# EasyEDA schematic LcsNodes-Block-Quad-Controller-B.00.05.json

## Sheets
1 High Level Schematic: TITLE: LcsNodes-Block-Quad-Controller\nHigh Level Schematic; REV: B.01.00; Date: 2023-02-08; Sheet: 1/7; Drawn By: helmut-f; Company: Your Company
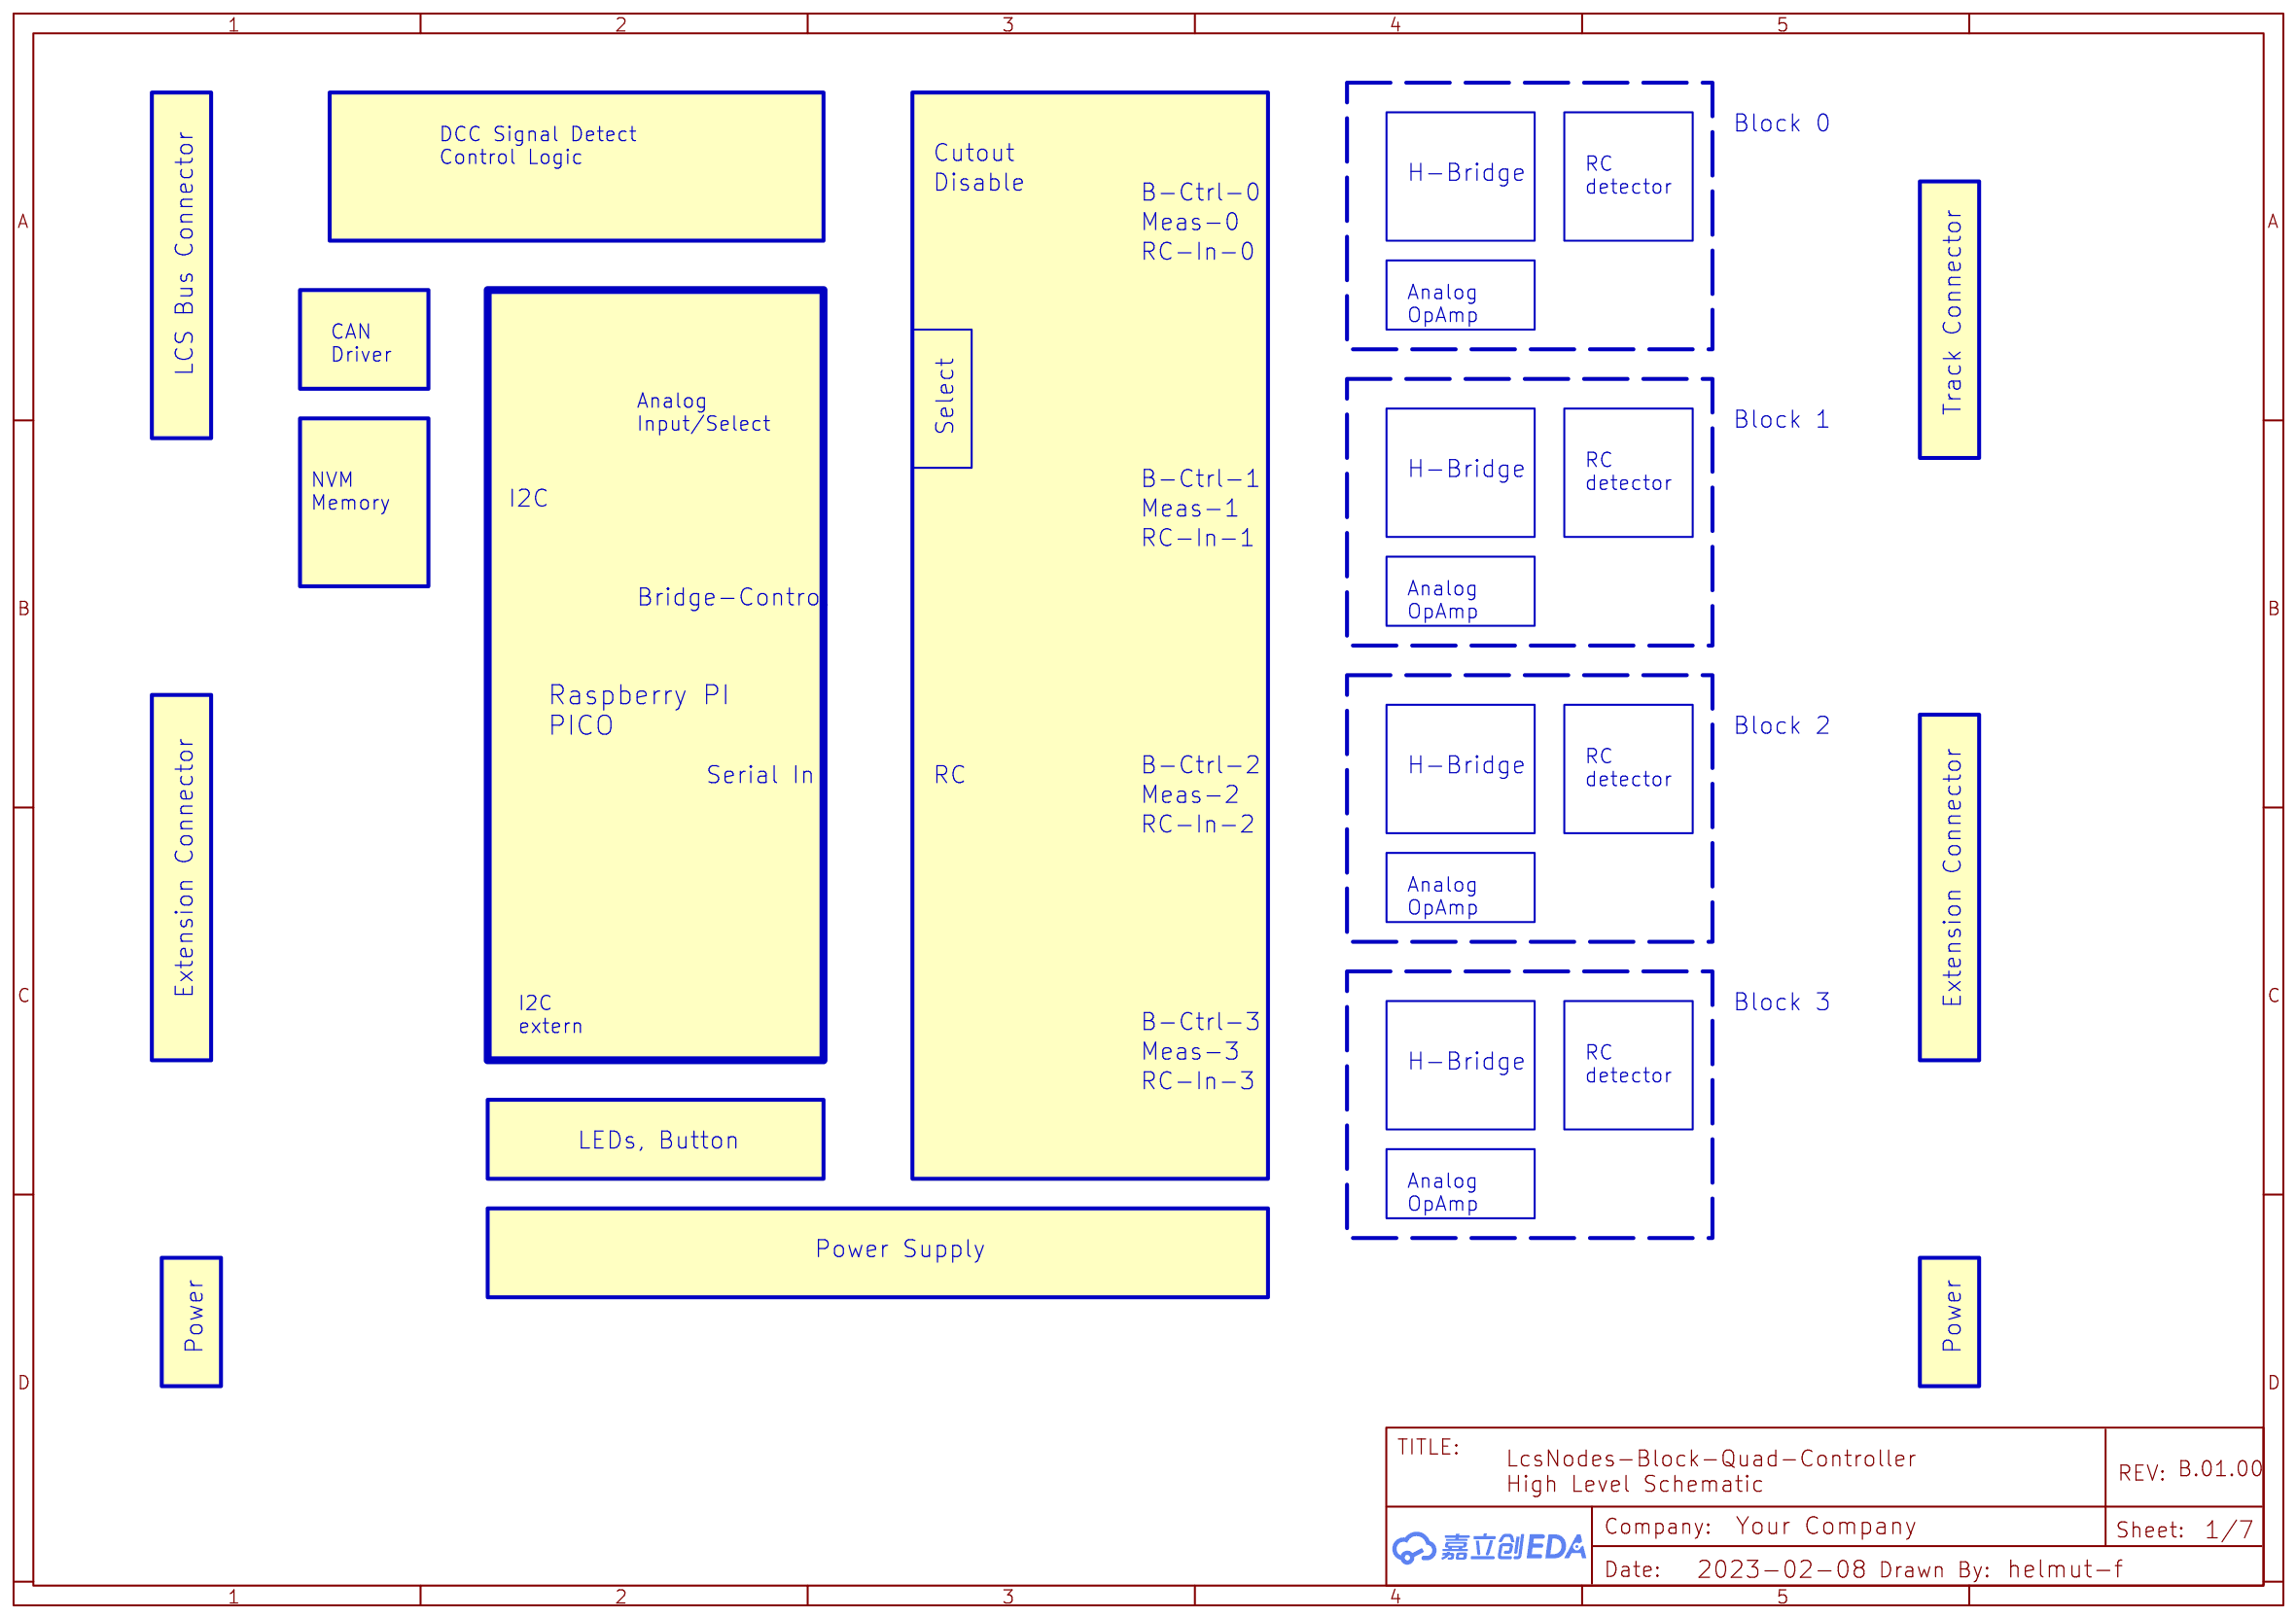
[diagram p0: High Level Schematic]
2 Control Logic: TITLE: LcsNodes-Block-Quad-Controller\nControl Logic; REV: B.00.04; Date: 2023-02-18; Sheet: 3/7
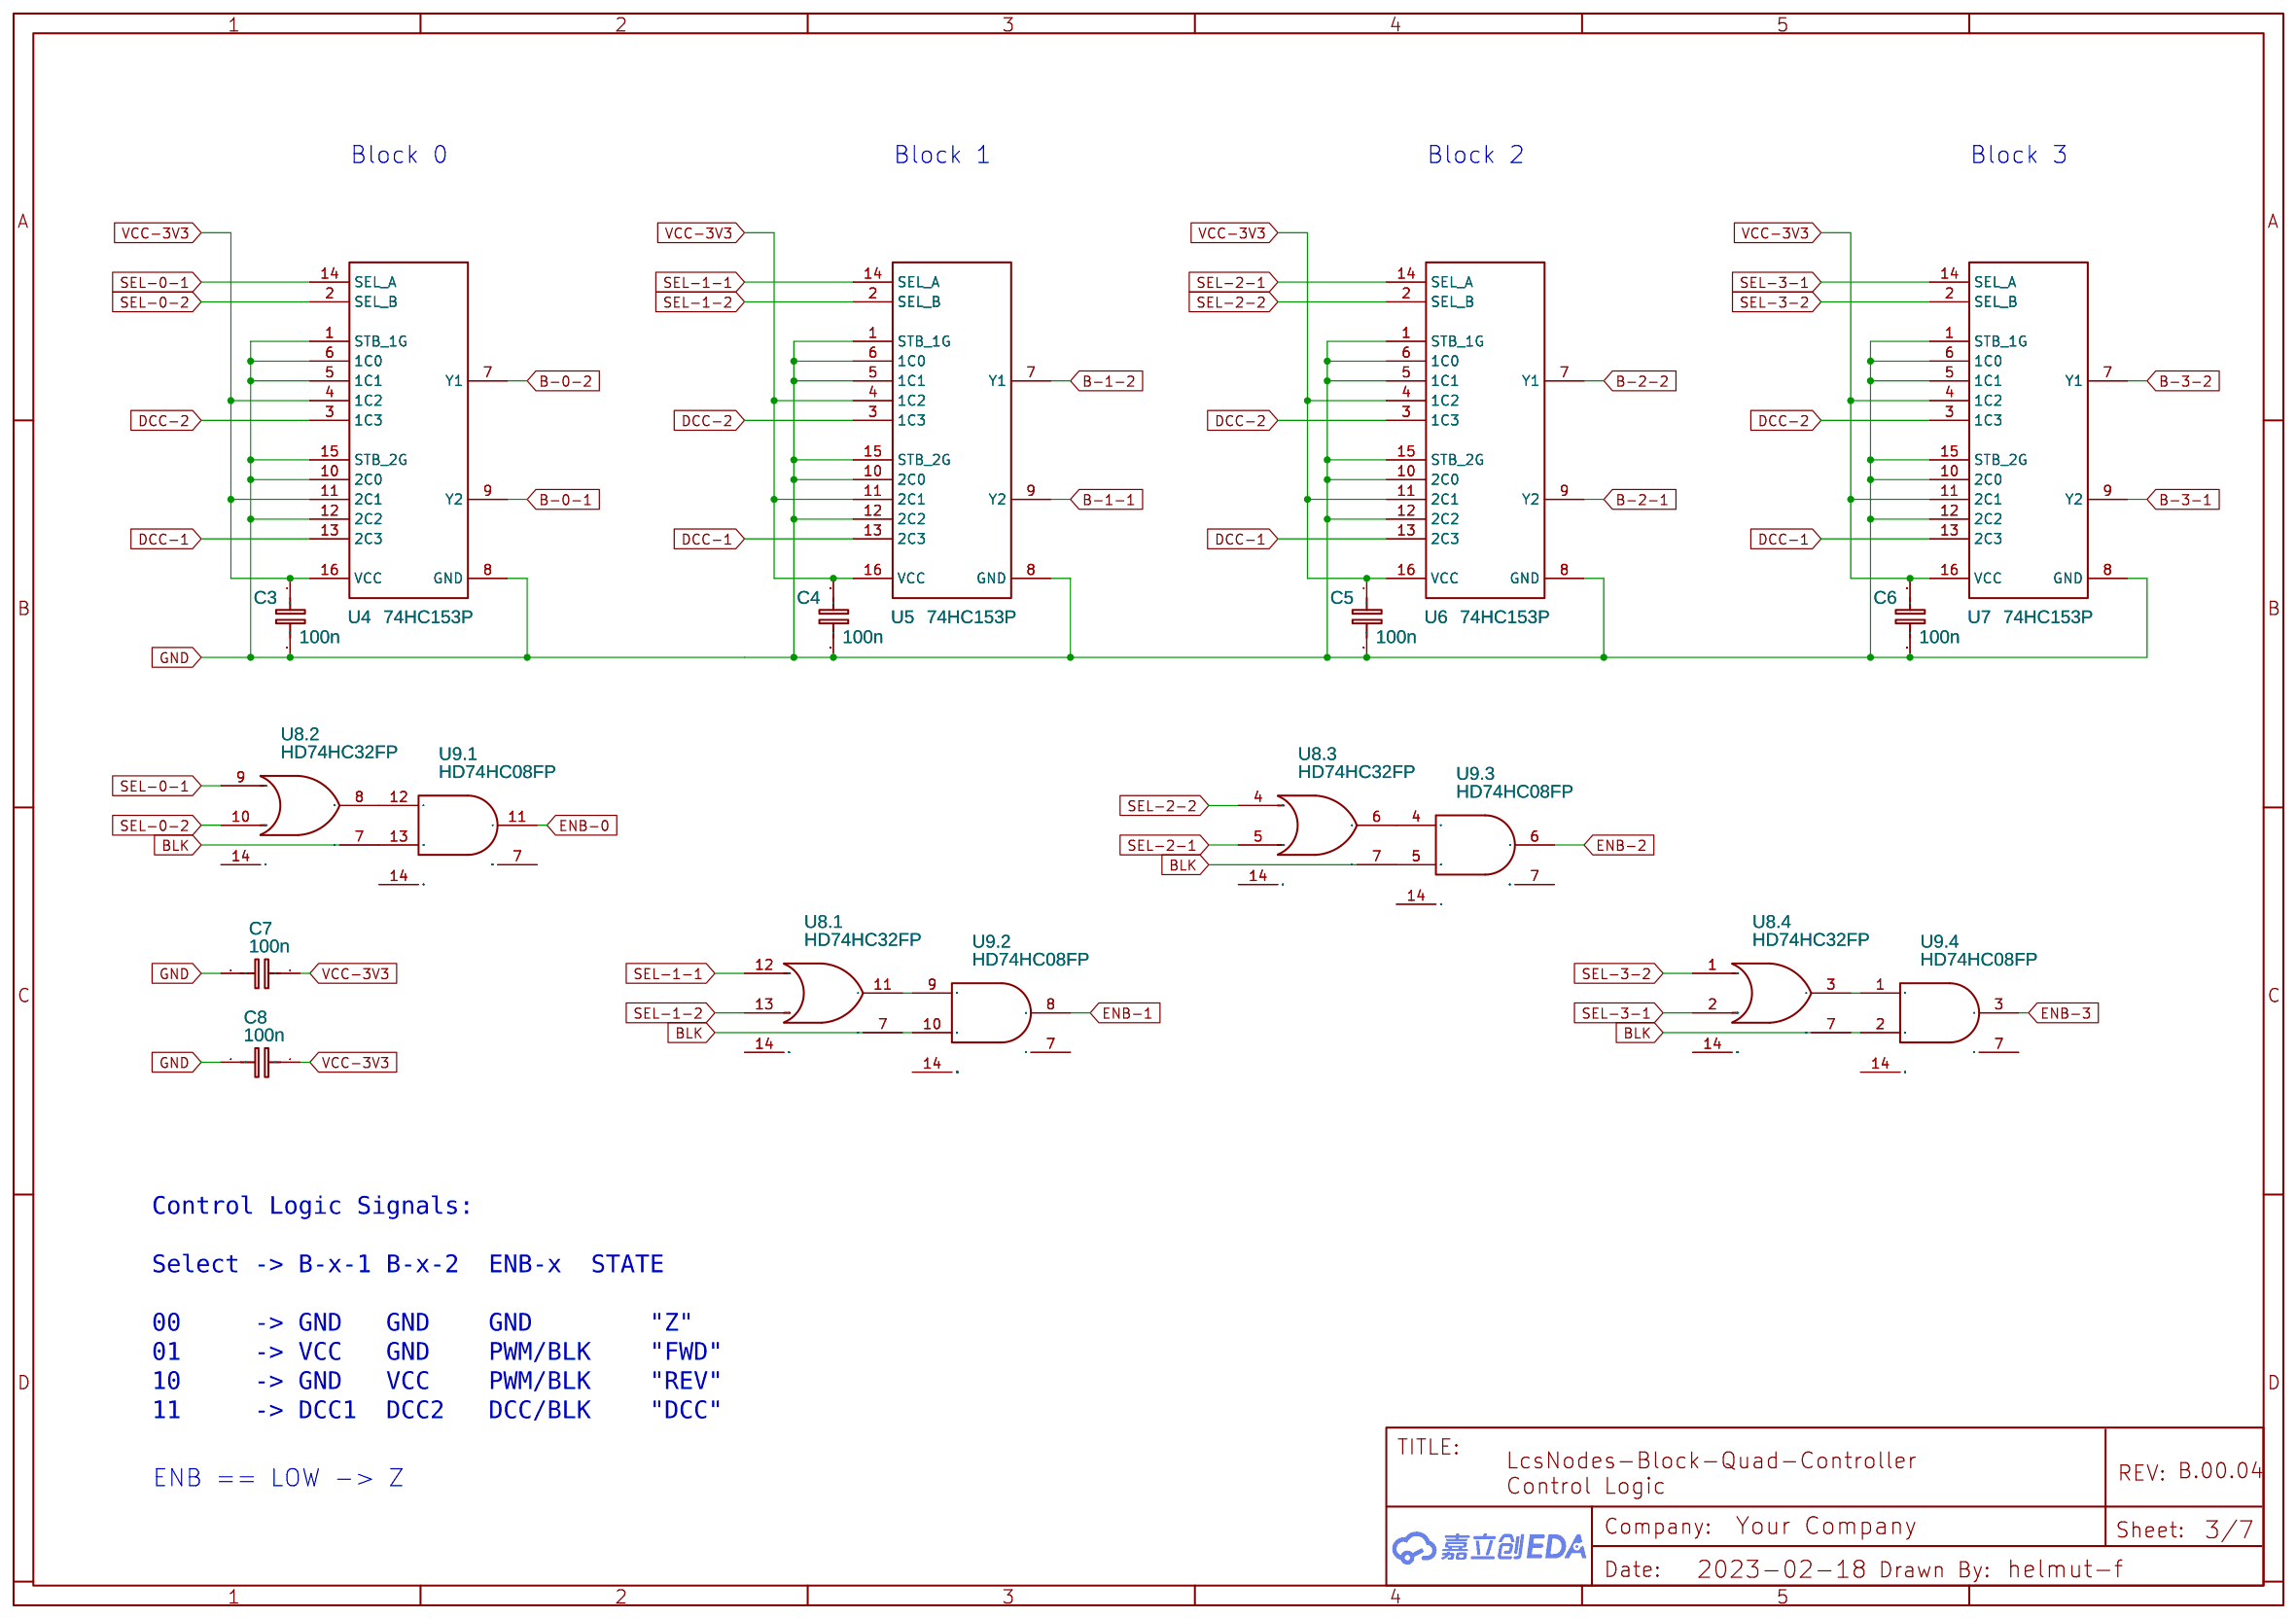
[diagram p1: Control Logic]
3 Main Controller: TITLE: LcsNodes-Block-Quad-Controller\nMain Controller; REV: B.00.04; Date: 2023-02-18; Sheet: 2/7
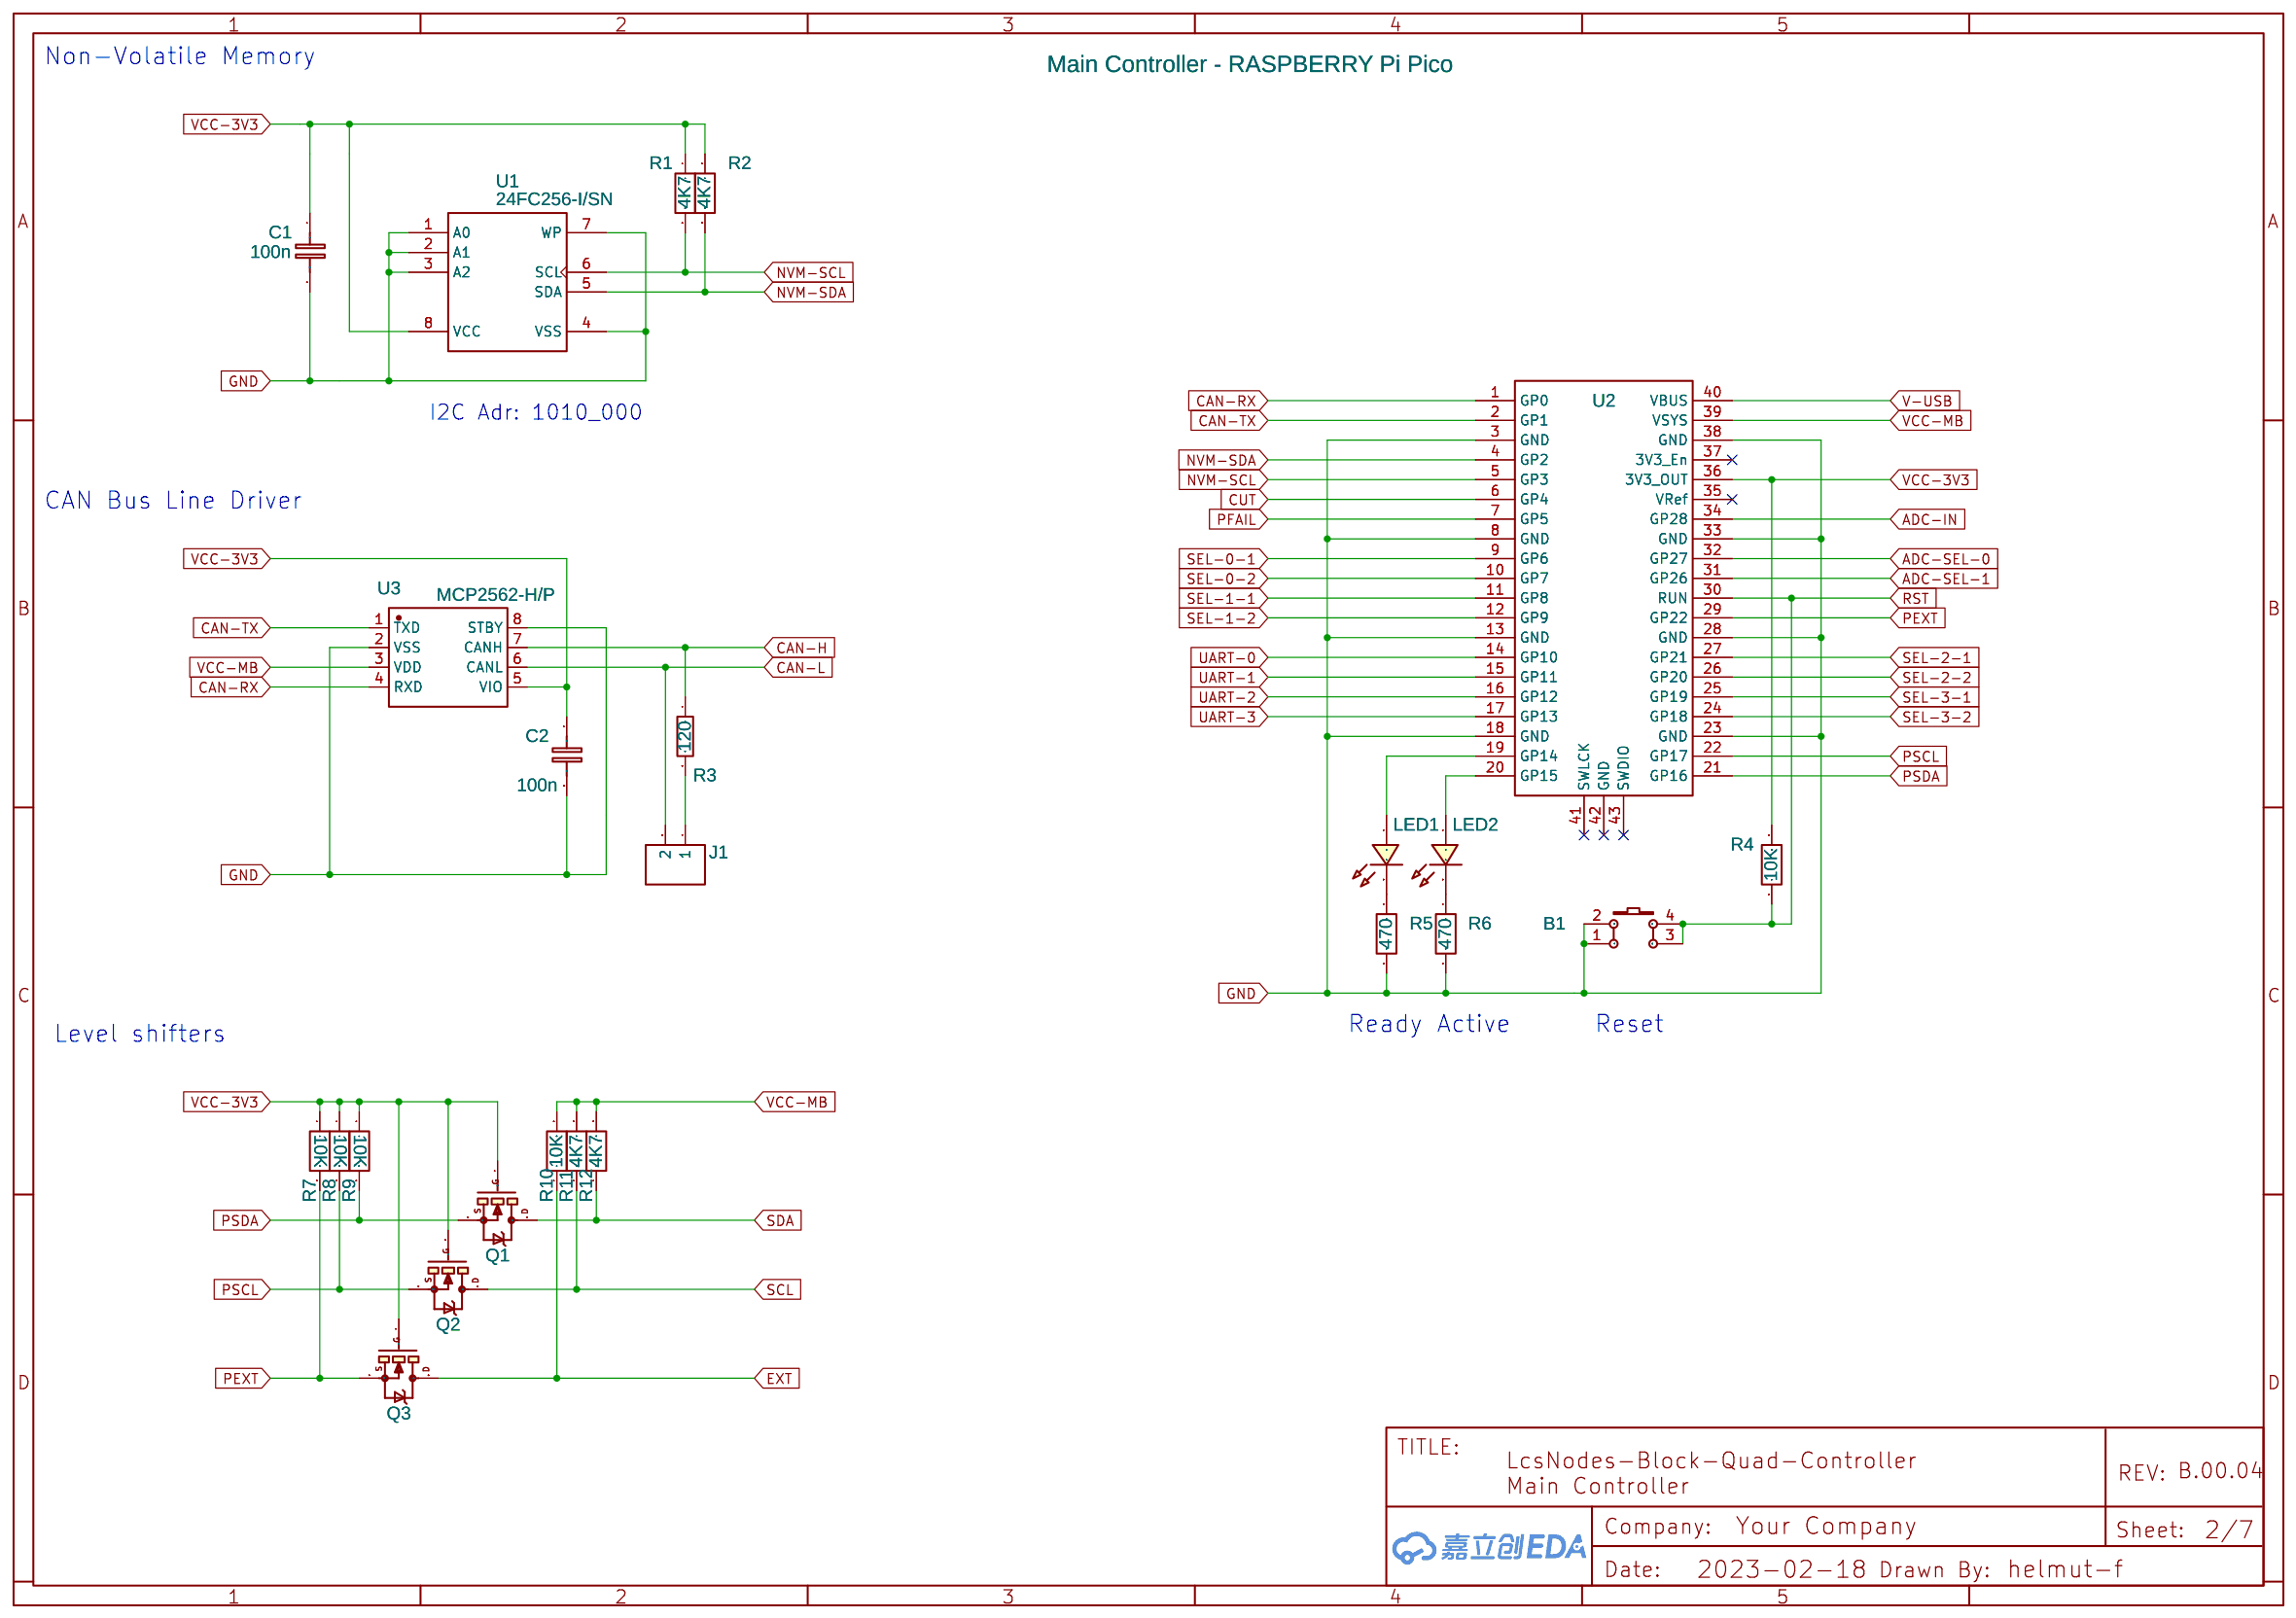
[diagram p2: Main Controller]
4 Quad Power Unit: TITLE: LcsNodes-Block-Quad-Controller\nQuad Power Unit; REV: B.00.04; Date: 2023-02-18; Sheet: 4/7
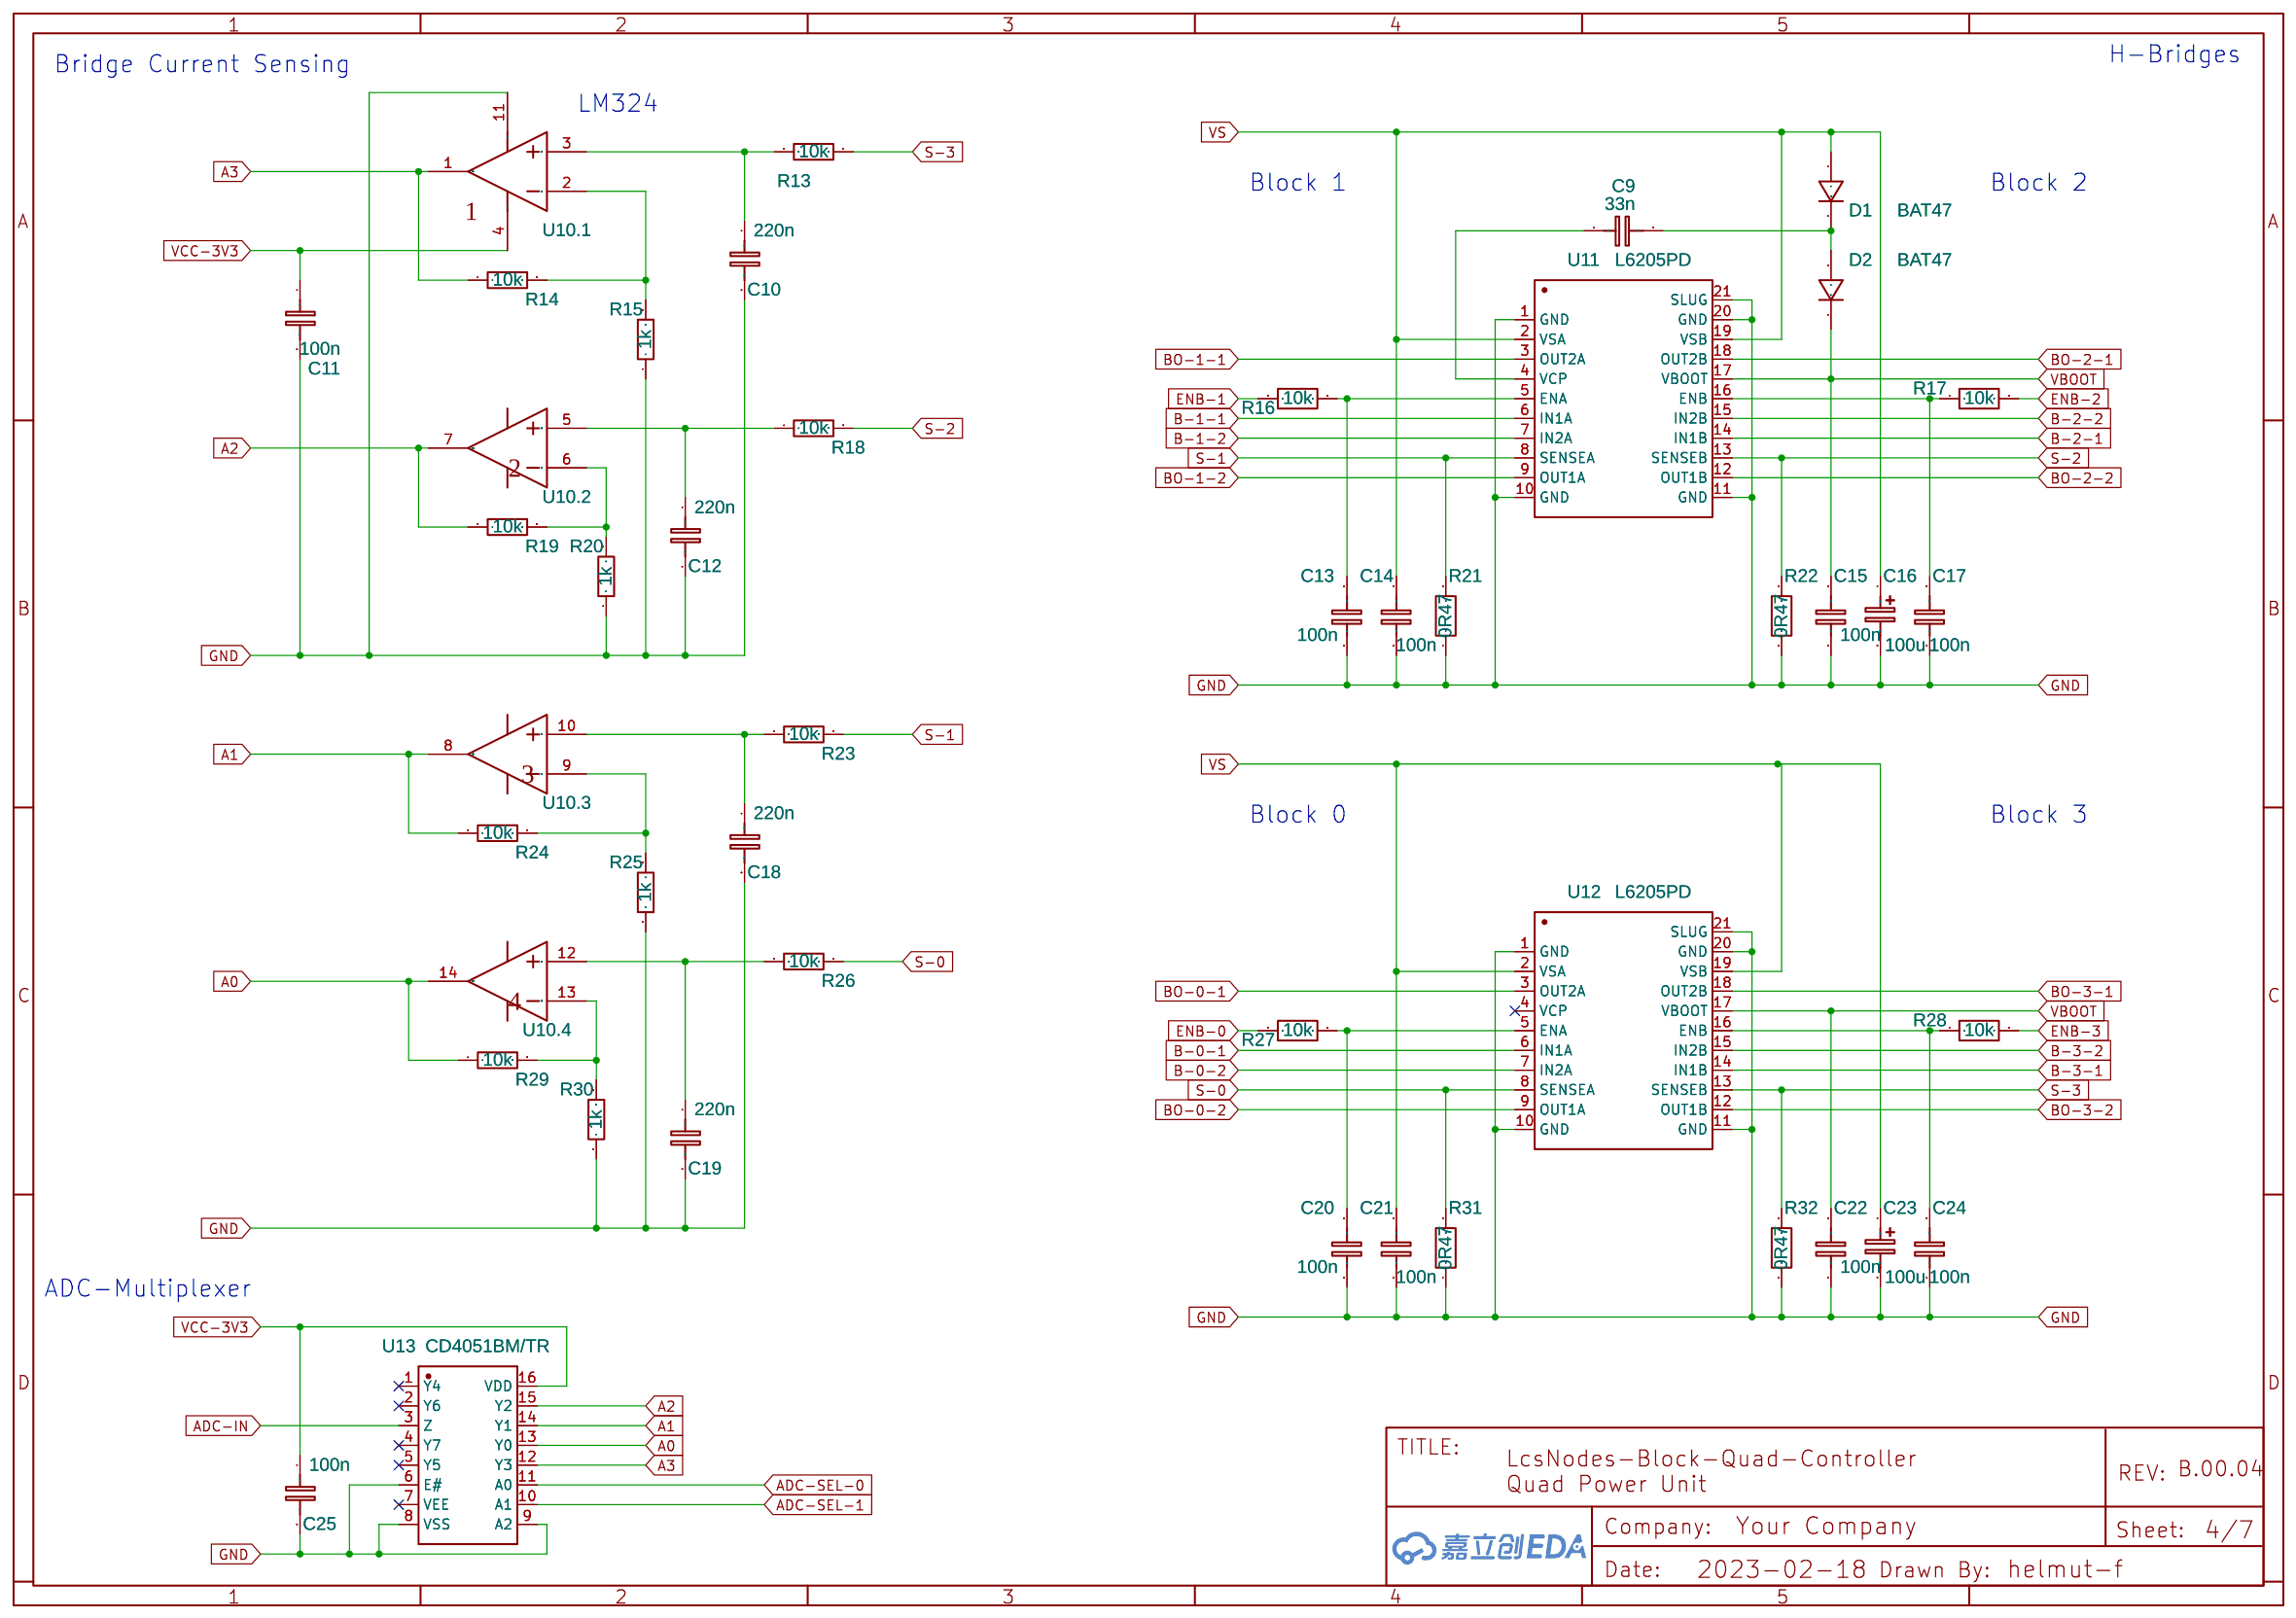
[diagram p3: Quad Power Unit]
5 Quad RailCom Detector: TITLE: LcsNodes-Block-Quad-Controllern\nQuad RailCom Detector; REV: B.00.04; Date: 2023-02-18; Sheet: 5/7
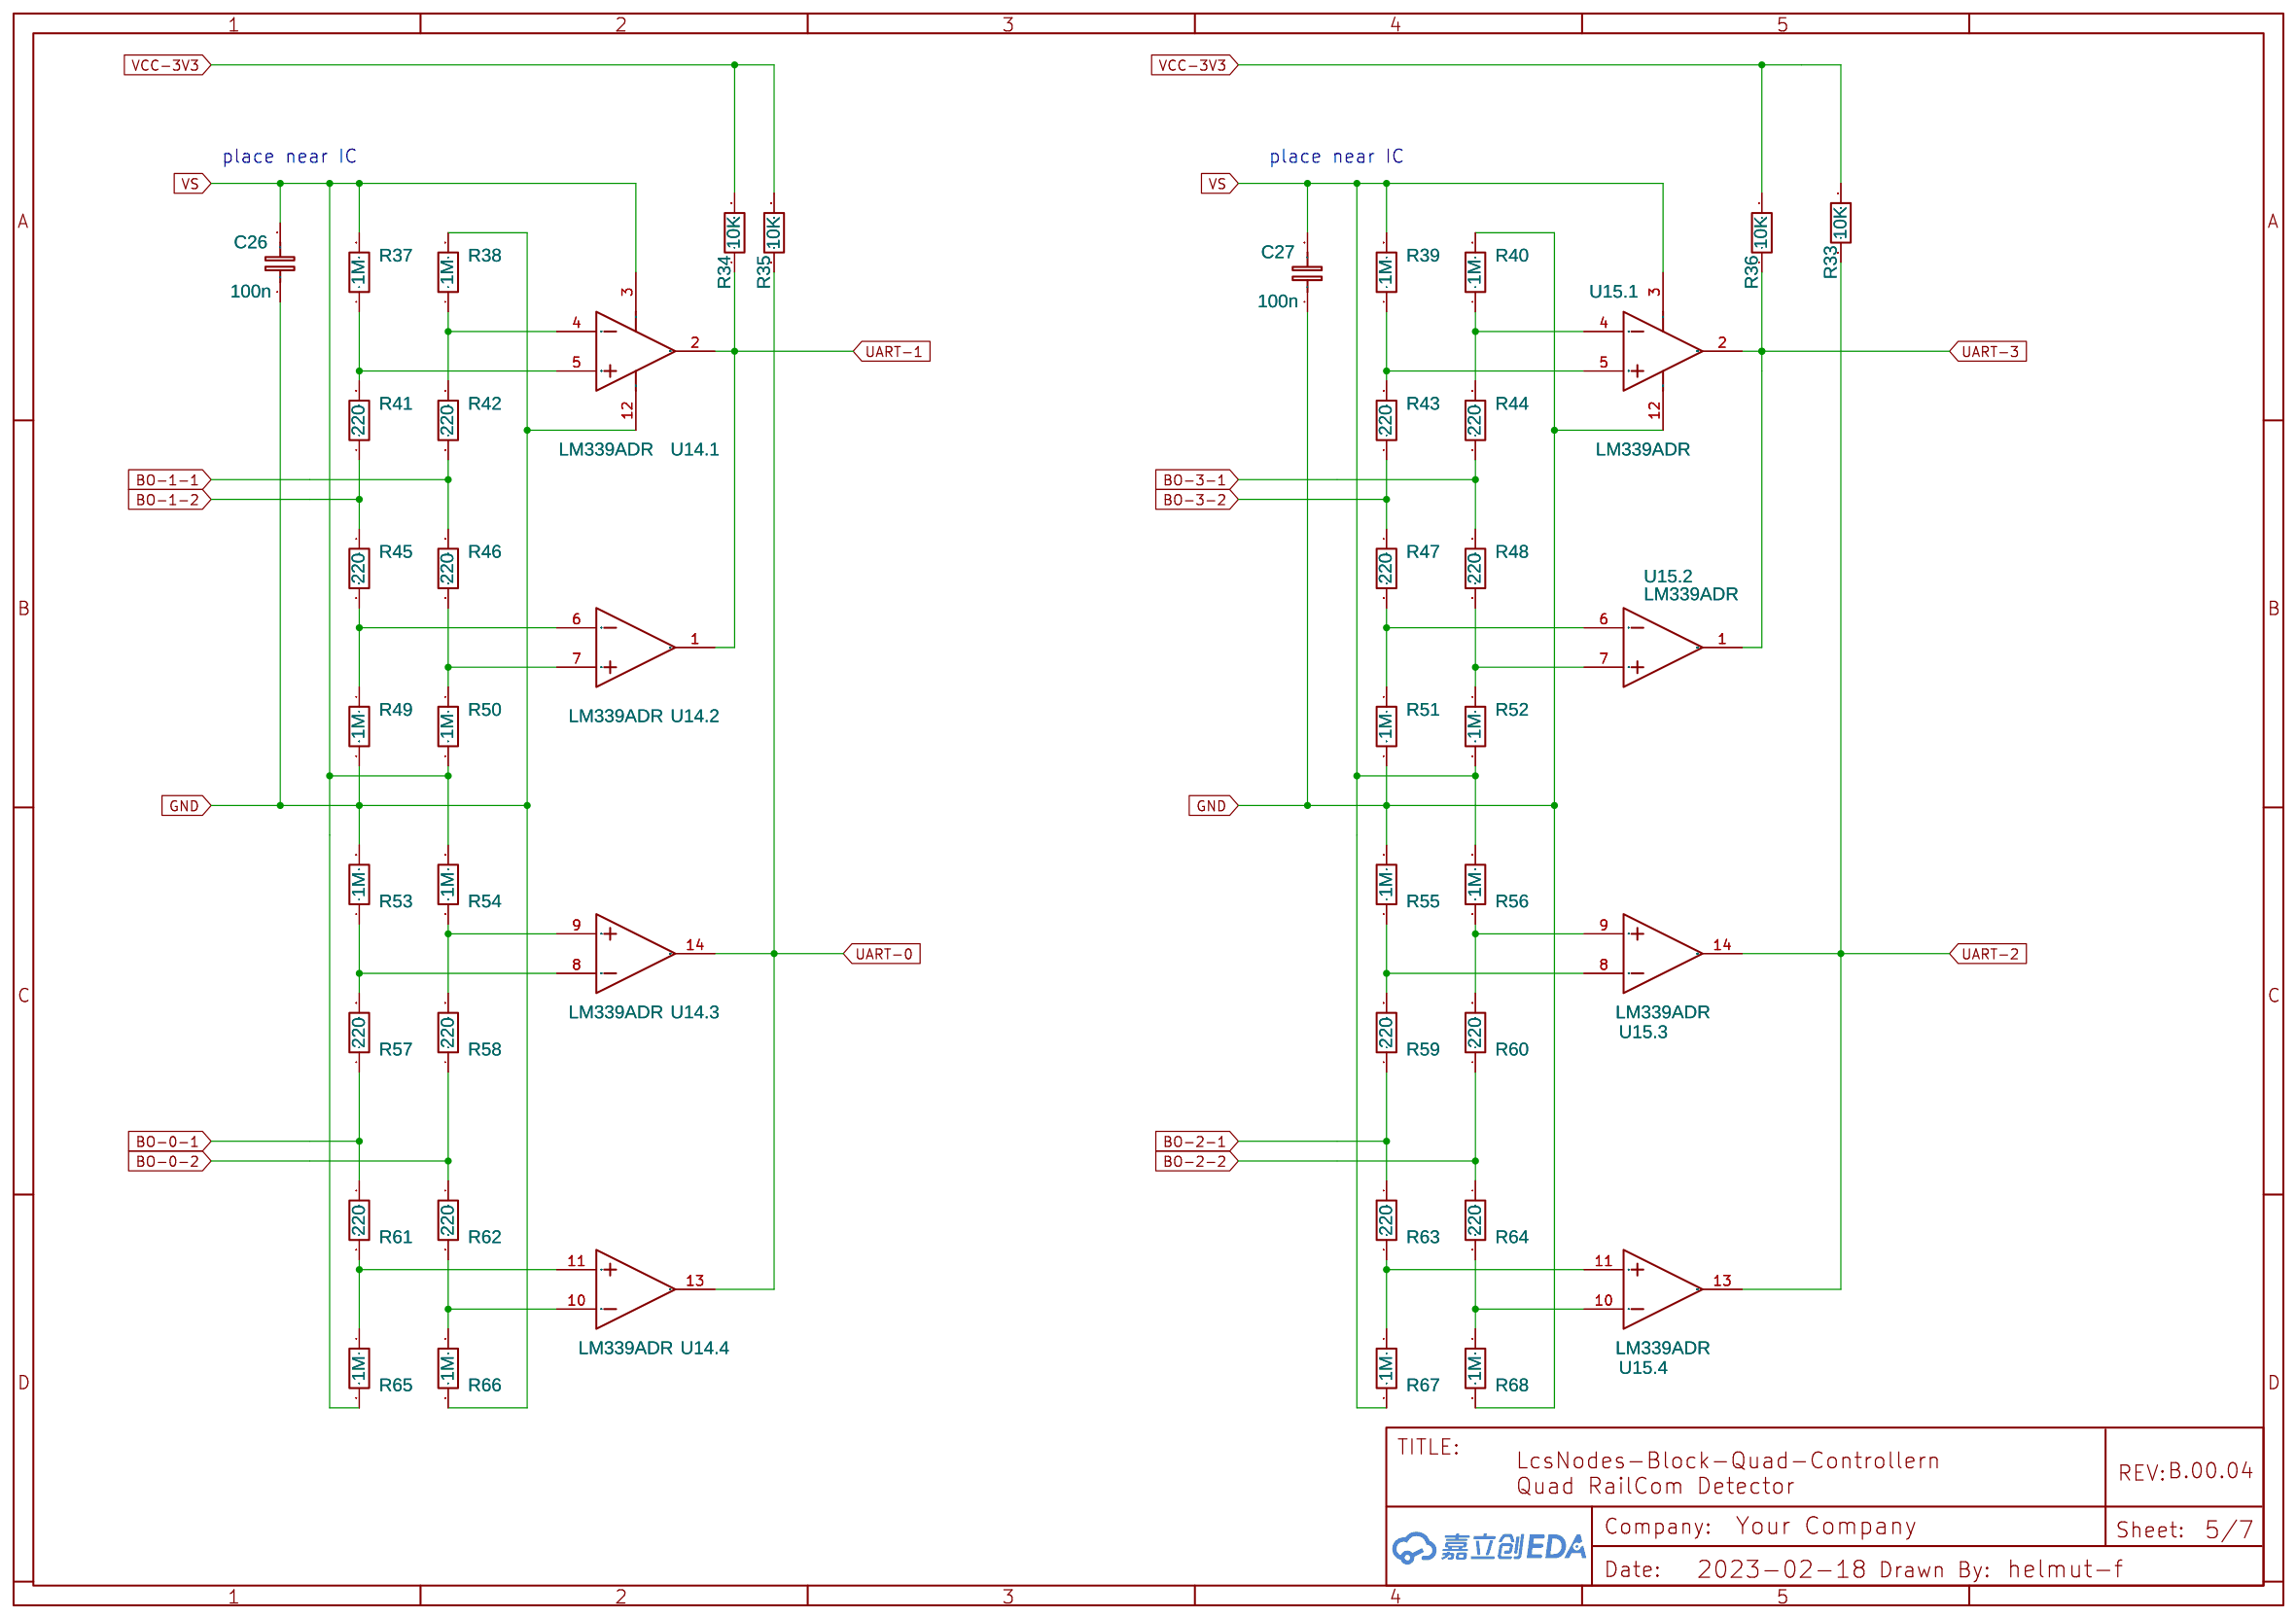
[diagram p4: Quad RailCom Detector]
6 Power Supply, Connectors: TITLE: LcsNodes-Block-Quad-Controller\nPower Supply, Connectors; REV: B.00.04; Date: 2023-02-18; Sheet: 7/7
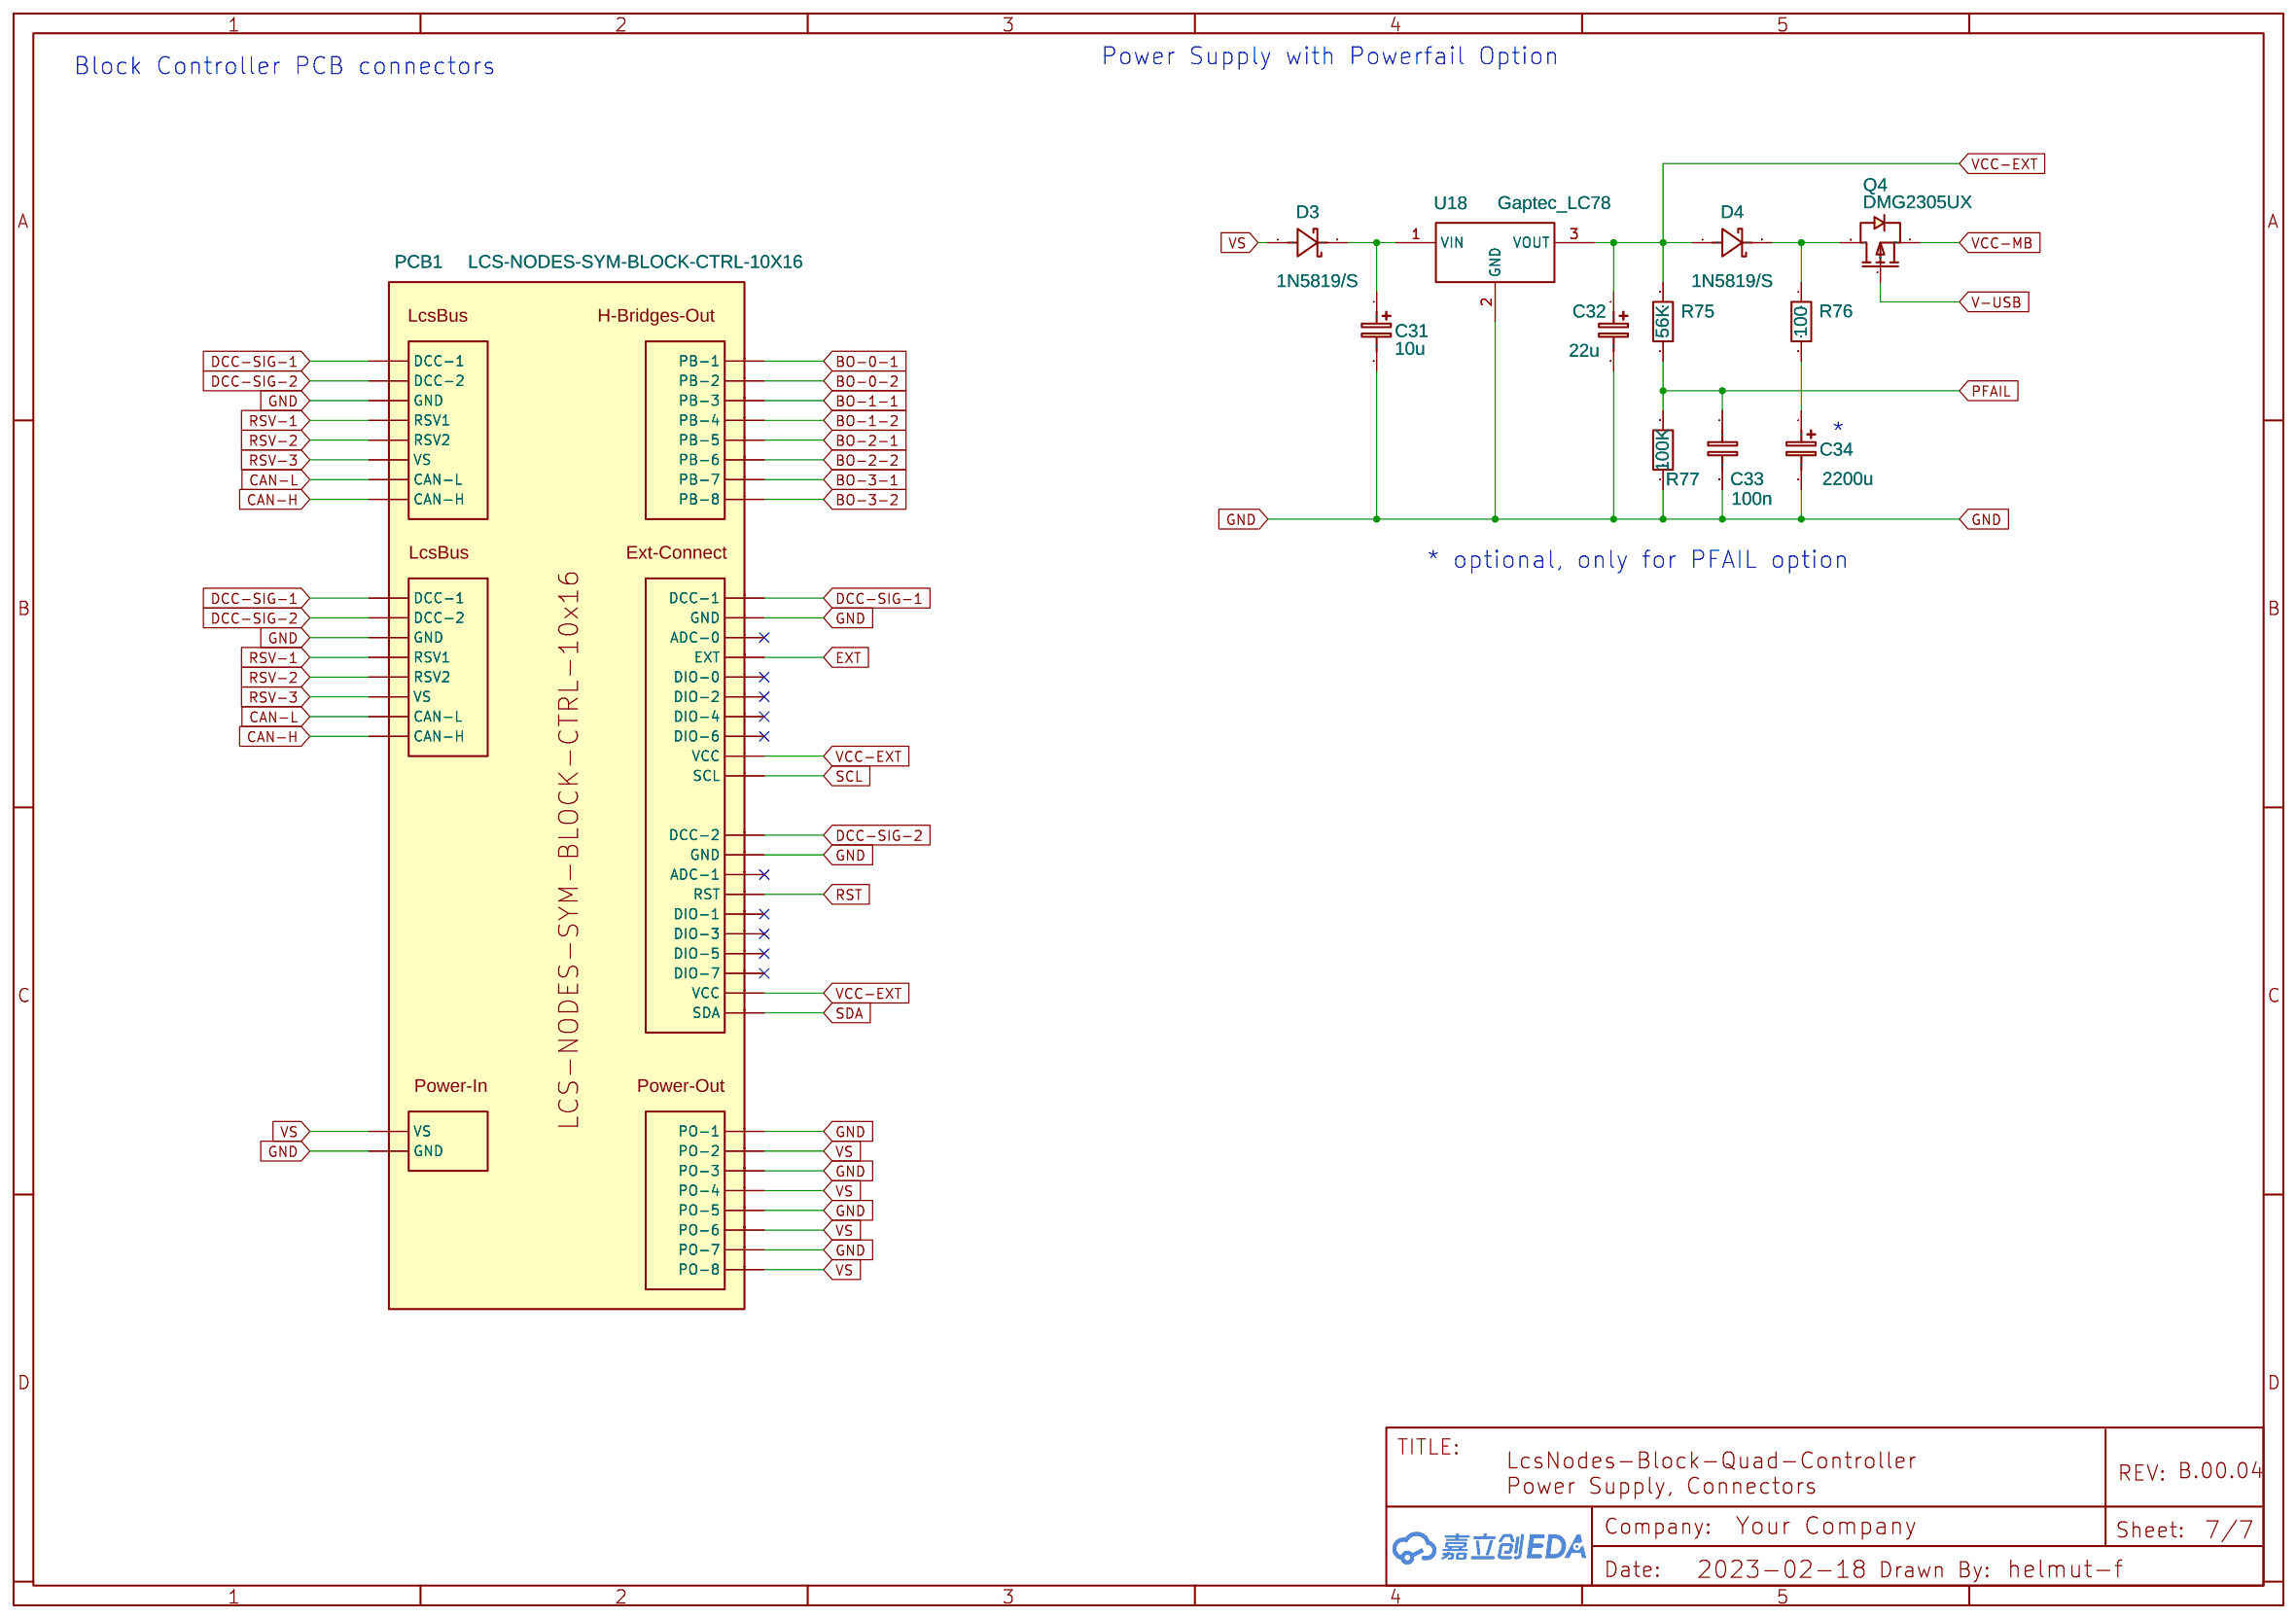
[diagram p5: Power Supply, Connectors]
7 DCC Signal Input: TITLE: LcsNodes-Block-Quad-Controller\nLCS Bus - DCC Signal Input; REV: B.00.04; Date: 2023-02-18; Sheet: 6/7
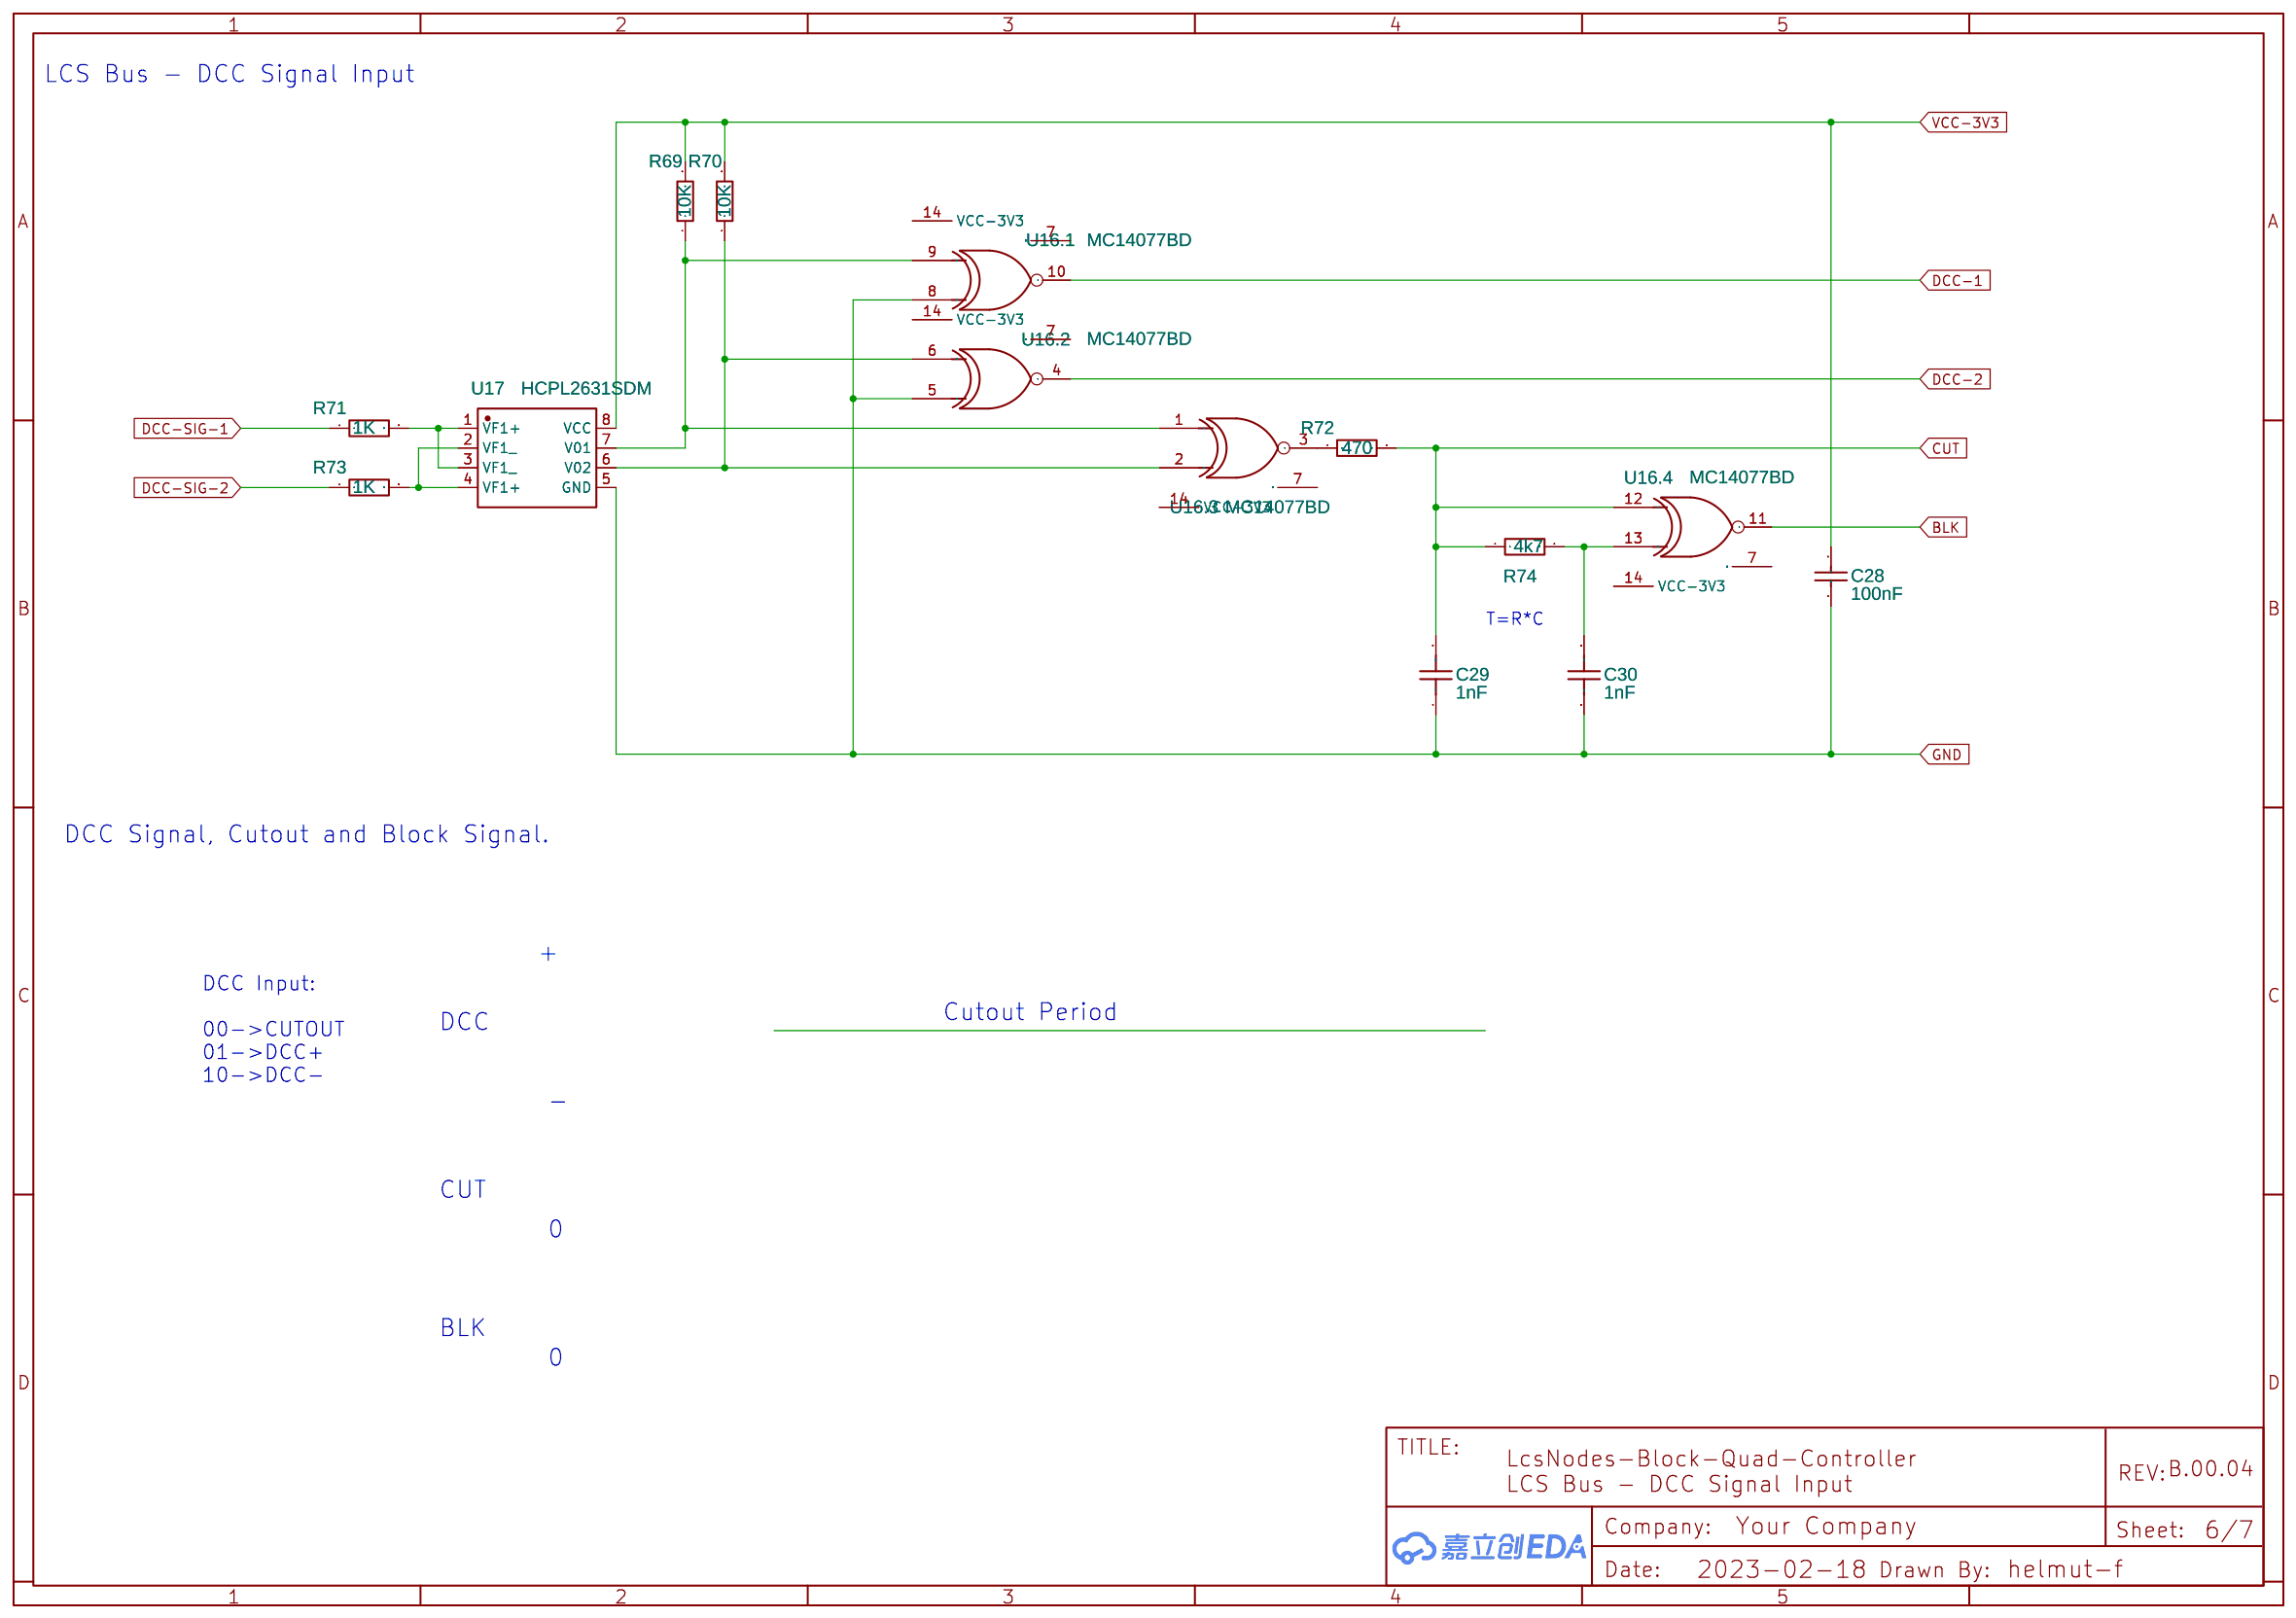
[diagram p6: DCC Signal Input]

## Parts
sheet Control Logic
C3  100n  [C1206]
C4  100n  [C1206]
C5  100n  [C1206]
C6  100n  [C1206]
C7  100n  [C1206]
C8  100n  [C1206]
U4  74HC153P  [SO-16_L9.9-W3.9-P1.27-LS6.0-BL]
U5  74HC153P  [SO-16_L9.9-W3.9-P1.27-LS6.0-BL]
U6  74HC153P  [SO-16_L9.9-W3.9-P1.27-LS6.0-BL]
U7  74HC153P  [SO-16_L9.9-W3.9-P1.27-LS6.0-BL]
U8  HD74HC32FP  [SO-14_L8.6-W3.9-P1.27-LS6.0-BL]  (sections 1,2,3,4)
U9  HD74HC08FP  [SO-14_L8.6-W3.9-P1.27-LS6.0-BL]  (sections 1,2,3,4)
sheet DCC Signal Input
C28  100nF  [C1206]
C29  1nF  [C1206]
C30  1nF  [C1206]
R69  10K  [R1206]
R70  10K  [R1206]
R71  1K  [R1206]
R72  470  [R1206]
R73  1K  [R1206]
R74  4k7  [R1206]
U16  MC14077BD  [SO-14_L8.6-W3.9-P1.27-LS6.0-BL]  (sections 1,2,3,4)
U17  HCPL2631SDM  [SMT-8_L9.7-W6.6-P2.54-LS10.3-TR]
sheet Main Controller
B1  Opt  [SW-SMD_4P-L6.0-W6.0-P4.50-LS9.0_C23873]
C1  100n  [C1206]
C2  100n  [C1206]
J1  HDR-M-2.54_1x2  [HDR-M-2.54_1X2]
LED1  LED-0603_R  [LED-1206]
LED2  LED-0805_G  [LED-1206]
Q1  MOSFET-NCHANNELBSS138  [SOT23-3]
Q2  MOSFET-NCHANNELBSS138  [SOT23-3]
Q3  MOSFET-NCHANNELBSS138  [SOT23-3]
R1  4K7  [R1206]
R2  4K7  [R1206]
R3  120  [R1206]
R4  10K  [R1206]
R5  470  [R1206]
R6  470  [R1206]
R7  10K  [R1206]
R8  10K  [R1206]
R9  10K  [R1206]
R10  10K  [R1206]
R11  4K7  [R1206]
R12  4K7  [R1206]
U1  24FC256-I/SN  [SOIC-8_L4.9-W3.9-P1.27-LS6.0-BL]
U2  Main Controller - RASPBERRY Pi Pico  [RASPBERRY PI PICO]
U3  MCP2562-H/P  [SOIC-8_L4.9-W3.9-P1.27-LS6.1-BL]
sheet Power Supply, Connectors
C31  10u  [CAP-D5.0×H5.5]
C32  22u  [CAP-D5.0×H5.5]
C33  100n  [C1206]
C34  2200u  [CAP-SMD_BD10.0-L10.3-W10.3-LS11.3-FD-1]
D3  1N5819/S  [SMA_L4.3-W2.6-LS5.2-R-RD]
D4  1N5819/S  [SMA_L4.3-W2.6-LS5.2-R-RD]
PCB1  LCS-NODES-SYM-BLOCK-CTRL-10X16  [LCS-NODES-FP-BLOCK-CTRL-10X16]
Q4  DMG2305UX  [SOT-23-3_L2.9-W1.3-P0.95-LS2.4-BR-1]
R75  56K  [R1206]
R76  100  [R1206]
R77  100K  [R1206]
U18  Gaptec_LC78  [GAPTEC_LC78]
sheet Quad Power Unit
C9  33n  [C1206]
C10  220n  [C1206]
C11  100n  [C1206]
C12  220n  [C1206]
C13  100n  [C1206]
C14  100n  [C1206]
C15  100n  [C1206]
C16  100u  [CAP-D6.3×H7.7]
C17  100n  [C1206]
C18  220n  [C1206]
C19  220n  [C1206]
C20  100n  [C1206]
C21  100n  [C1206]
C22  100n  [C1206]
C23  100u  [CAP-D6.3×H7.7]
C24  100n  [C1206]
C25  100n  [C1206]
D1  BAT47  [SOD-80C_L3.3-W1.5-RD]
D2  BAT47  [SOD-80C_L3.3-W1.5-RD]
R13  10k  [R1206]
R14  10k  [R1206]
R15  1k  [R1206]
R16  10k  [R1206]
R17  10k  [R1206]
R18  10k  [R1206]
R19  10k  [R1206]
R20  1k  [R1206]
R21  0R47  [R_AXIAL-0.7]
R22  0R47  [R_AXIAL-0.7]
R23  10k  [R1206]
R24  10k  [R1206]
R25  1k  [R1206]
R26  10k  [R1206]
R27  10k  [R1206]
R28  10k  [R1206]
R29  10k  [R1206]
R30  1k  [R1206]
R31  0R47  [R_AXIAL-0.7]
R32  0R47  [R_AXIAL-0.7]
U10  LM324-SR_C280708  [SO-14_L8.6-W3.9-P1.27-LS6.0-BL]  (sections 1,2,3,4)
U11  L6205PD  [POWERSO20_L15.9-W11.0-P1.27-LS14.2-BL-EP]
U12  L6205PD  [POWERSO20_L15.9-W11.0-P1.27-LS14.2-BL-EP]
U13  CD4051BM/TR  [SO-16_L9.9-W3.9-P1.27-LS6.1-BL]
sheet Quad RailCom Detector
C26  100n  [C1206]
C27  100n  [C1206]
R33  10K  [R1206]
R34  10K  [R1206]
R35  10K  [R1206]
R36  10K  [R1206]
R37  1M  [R1206]
R38  1M  [R1206]
R39  1M  [R1206]
R40  1M  [R1206]
R41  220  [R1206]
R42  220  [R1206]
R43  220  [R1206]
R44  220  [R1206]
R45  220  [R1206]
R46  220  [R1206]
R47  220  [R1206]
R48  220  [R1206]
R49  1M  [R1206]
R50  1M  [R1206]
R51  1M  [R1206]
R52  1M  [R1206]
R53  1M  [R1206]
R54  1M  [R1206]
R55  1M  [R1206]
R56  1M  [R1206]
R57  220  [R1206]
R58  220  [R1206]
R59  220  [R1206]
R60  220  [R1206]
R61  220  [R1206]
R62  220  [R1206]
R63  220  [R1206]
R64  220  [R1206]
R65  1M  [R1206]
R66  1M  [R1206]
R67  1M  [R1206]
R68  1M  [R1206]
U14  LM339ADR  [SO-14_L8.6-W3.9-P1.27-LS6.0-BL]  (sections 1,2,3,4)
U15  LM339ADR  [SO-14_L8.6-W3.9-P1.27-LS6.0-BL]  (sections 1,2,3,4)

## Library data of the parts
C1-C8 C10-C12 C18 C19 C25-C27 = C_0603_EU: Contributor: LCEDA_Lib; Package Display: No
U4-U7 = HD74HC153P: Dual 4-to-1 Line Data Selectors  Multiplexers; sourceId: apMfR4kcT
U8 = HD74HC32FP: Quad 2-Input OR Gates; subpart_no: 1
U9 = HD74HC08FP: Quad 2-Input AND Gates; subpart_no: 1
C28 = CC1206KKX7R0BB104: Supplier: LCSC; Manufacturer: YAGEO(国巨); Supplier Part: C107181; JLCPCB Part Class: Extended Part; link: https://lcsc.com/eda_search?q=C107181&%26type=1&ref=editor
C29 C30 = CC1206JRNPO9BN102: Contributor: LCSC; Supplier: LCSC; Supplier Part: C113881; Manufacturer: YAGEO(国巨); JLCPCB Part Class: Extended Part; link: https://lcsc.com/eda_search?q=C113881&%26type=1&ref=editor
R69-R71 R73 = SR1206JR-7W4K7L: Contributor: LCSC; Supplier: LCSC; Supplier Part: C326768; Manufacturer: YAGEO(国巨); JLCPCB Part Class: Extended Part; link: https://lcsc.com/eda_search?q=C326768&%26type=1&ref=editor
R72 R74 = 1206W4F1001T5E: Supplier: LCSC; Manufacturer: UNI-ROYAL(厚声); Supplier Part: C4410; JLCPCB Part Class: Basic Part; link: https://lcsc.com/eda_search?q=C4410&%26type=1&ref=editor
U16 = MC14077BD: Quad XNOR Gate; subpart_no: 1; Package Display: No
U17 = HCPL2631SDM: Contributor: LCSC; Supplier: LCSC; Supplier Part: C899529; Manufacturer: onsemi(安森美); JLCPCB Part Class: Extended Part
B1 = K4-6×6_TH: Supplier: LCSC; Supplier Part: C136684; Manufacturer: 韩国韩荣; Manufacturer Part: K2-1102DP-E4SW-04; Contributor: LCEDA_Lib; Package Display: No
J1 = HDR-M-2.54_1x2: Supplier Part: C124375; Supplier: LCSC; Contributor: LCEDA_Lib
LED1 = LED-0603_R: Manufacturer: EVERLIGHT(台湾亿光); Manufacturer Part: 19-217/R6C-AL1M2VY/3T; Supplier Part: C72044; Supplier: LCSC; Contributor: LCEDA_01
LED2 = LED-0805_G: Manufacturer: 国星光电; Manufacturer Part: NCD0805G1; Supplier Part: C84260; Contributor: LCEDA_Lib
Q1-Q3 = MOSFET-NCHANNELBSS138: Common NMOSFET Parts; Contributor: SparkFun
R1 R2 R4-R12 = R_0805_EU: Contributor: LCEDA_Lib
R3 R13-R15 R18-R20 R23-R26 R29 R30 = RESISTOR-AXIAL-0.1
U1 = 24FC256-I/SN: Supplier: LCSC; Manufacturer: MICROCHIP(美国微芯); Contributor: LCSC; Supplier Part: C145385; JLCPCB Part Class: Extended Part
U2 = RASPBERRY Pi Pico Through Holes: Contributor: untung91
U3 = MCP2562-H/P: Supplier: LCSC; Supplier Part: C640348; Manufacturer: MICROCHIP(美国微芯); link: https://atta.szlcsc.comnull; Contributor: lcsc
C16 C23 C31 C32 = CE_SMD_D5.0×H5.5_EU: Contributor: LCEDA_Lib
C33 = C_RAD-0.2_EU: Contributor: LCEDA_Lib
C34 = C_Tan_SMD_A_EU: Contributor: LCEDA_Lib
D3 D4 = 1N5819/S: Supplier: LCSC; Supplier Part: C9900003833; JLCPCB Part Class: Extended Part; Contributor: LCSC
PCB1 = LCS-NODES-SYM-BLOCK-CTRL-10X16: Contributor: helmut-f; Package Display: No
Q4 = DMG2305UX: Supplier: LCSC; Supplier Part: C2940629; Manufacturer: TECH PUBLIC(台舟); link: https://atta.szlcsc.com//upload/public/pdf/source/20220124/672A40BC72F4DE27873D6595D2E3AF1A.pdf; Contributor: LCSC; JLCPCB Part Class: Extended Part
R16 R17 R27 R28 R33-R68 R75-R77 = R_AXIAL-0.3_EU: Contributor: LCEDA_Lib
U18 = Gaptec_LC78: Contributor: SpicyMemeBoi; Package Display: No
C9 C13-C15 C17 C20-C22 C24 = C_0603_EU: Contributor: LCEDA_Lib
D1 D2 = 1N4148: Supplier: LCSC; Manufacturer: SEMTECH; Supplier Part: C14516; Contributor: LCEDA_Lib
R21 R22 R31 R32 = R_AXIAL-0.5_EU: Contributor: LCEDA_Lib
U10 = LM324-SR_C280708: Supplier: LCSC; Supplier Part: C280708; Manufacturer: Gainsil(聚洵); Manufacturer Part: LM324-SR; subpart_no: 1; JLCPCB Part Class: Extended Part; Package Display: No
U11 U12 = L6205PD: Supplier: LCSC; Manufacturer: ST(意法半导体); Manufacturer Part: L6205PD013TR; Supplier Part: C36543; JLCPCB Part Class: Extended Part
U13 = CD4051BM/TR: Supplier: LCSC; Supplier Part: C507163; Manufacturer: HGSEMI(华冠); Contributor: LCSC; JLCPCB Part Class: Extended Part; Package Display: No
U14 U15 = LM339ADR: Supplier Part: C74559; Supplier: LCSC; Manufacturer Part: TI; subpart_no: 1; JLCPCB Part Class: Extended Part

## Nets
GND: B1.1 B1.2 C1.2 C2.2 C3.2 C4.2 C5.2 C6.2 C7.2 C8.2 C10.2 C11.2 C12.2 C13.1 C14.1 C15.1 C16.2 C17.1 C18.2 C19.2 C20.1 C21.1 C22.1 C23.2 C24.1 C25.2 C26.1 C27.1 C28.1 C29.1 C30.1 C31.2 C32.2 C33.2 C34.2 PCB1.3(GND) PCB1.13(GND) PCB1.21(GND) PCB1.41(GND) PCB1.52(GND) PCB1.60(PO-1) PCB1.61(PO-3) PCB1.62(PO-5) PCB1.63(PO-7) R5.2 R6.2 R15.1 R20.1 R21.1 R22.1 R25.1 R30.1 R31.1 R32.1 R38.2 R40.2 R49.2 R51.2 R53.2 R55.2 R66.2 R68.2 R77.1 U1.1(A0) U1.2(A1) U1.3(A2) U1.4(VSS) U1.7(WP) U2.3(GND) U2.8(GND) U2.13(GND) U2.18(GND) U2.23(GND) U2.28(GND) U2.33(GND) U2.38(GND) U3.2(VSS) U3.8(STBY) U4.1(STB 1G) U4.5(1C1) U4.6(1C0) U4.8(GND) U4.10(2C0) U4.12(2C2) U4.15(STB 2G) U5.1(STB 1G) U5.5(1C1) U5.6(1C0) U5.8(GND) U5.10(2C0) U5.12(2C2) U5.15(STB 2G) U6.1(STB 1G) U6.5(1C1) U6.6(1C0) U6.8(GND) U6.10(2C0) U6.12(2C2) U6.15(STB 2G) U7.1(STB 1G) U7.5(1C1) U7.6(1C0) U7.8(GND) U7.10(2C0) U7.12(2C2) U7.15(STB 2G) U10.11(VSS) U11.1(GND) U11.10(GND) U11.11(GND) U11.20(GND) U11.21(SLUG) U12.1(GND) U12.10(GND) U12.11(GND) U12.20(GND) U12.21(SLUG) U13.6(E#) U13.8(VSS) U13.9(A2) U14.12(GND) U15.12(GND) U16.5(A) U16.8(A) U17.5(GND) U18.2(GND)
VCC-3V3: C1.1 C2.1 C3.1 C4.1 C5.1 C6.1 C7.1 C8.1 C11.1 C25.1 C28.2 Q1.1(G) Q2.1(G) Q3.1(G) R1.1 R2.1 R4.2 R7.1 R8.1 R9.1 R33.1 R34.2 R35.1 R36.2 R69.2 R70.2 U1.8(VCC) U2.36(3V3_OUT) U3.5(VIO) U4.4(1C2) U4.11(2C1) U4.16(VCC) U5.4(1C2) U5.11(2C1) U5.16(VCC) U6.4(1C2) U6.11(2C1) U6.16(VCC) U7.4(1C2) U7.11(2C1) U7.16(VCC) U10.4(VDD) U13.16(VDD) U17.8(VCC)
VCC-EXT: C32.1 D4.1(A) PCB1.48(VCC) PCB1.58(VCC) R75.2 U18.3(VOUT)
VCC-MB: Q4.2(S) R10.2 R11.2 R12.2 U2.39(VSYS) U3.3(VDD)
A0: R29.1 U10.14(OUTD) U13.13(Y0)
A1: R24.1 U10.8(OUTC) U13.14(Y1)
A2: R19.1 U10.7(OUTB) U13.15(Y2)
A3: R14.1 U10.1(OUTA) U13.12(Y3)
ADC-IN: U2.34(GP28) U13.3(Z)
ADC-SEL-0: U2.32(GP27) U13.11(A0)
ADC-SEL-1: U2.31(GP26) U13.10(A1)
B-0-1: U4.9(Y2) U12.6(IN1A)
B-0-2: U4.7(Y1) U12.7(IN2A)
B-1-1: U5.9(Y2) U11.6(IN1A)
B-1-2: U5.7(Y1) U11.7(IN2A)
B-2-1: U6.9(Y2) U11.14(IN1B)
B-2-2: U6.7(Y1) U11.15(IN2B)
B-3-1: U7.9(Y2) U12.14(IN1B)
B-3-2: U7.7(Y1) U12.15(IN2B)
BLK: U8.7(GND) U9.2(1B) U9.5(2B) U9.10(3B) U9.13(4B) U16.11(Y)
BO-0-1: PCB1.30(PB-1) R57.1 R61.1 U12.3(OUT2A)
BO-0-2: PCB1.34(PB-2) R58.1 R62.1 U12.9(OUT1A)
BO-1-1: PCB1.31(PB-3) R42.1 R46.1 U11.3(OUT2A)
BO-1-2: PCB1.35(PB-4) R41.1 R45.1 U11.9(OUT1A)
BO-2-1: PCB1.32(PB-5) R59.1 R63.1 U11.18(OUT2B)
BO-2-2: PCB1.36(PB-6) R60.1 R64.1 U11.12(OUT1B)
BO-3-1: PCB1.33(PB-7) R44.1 R48.1 U12.18(OUT2B)
BO-3-2: PCB1.37(PB-8) R43.1 R47.1 U12.12(OUT1B)
CAN-H: PCB1.8(CAN-H) PCB1.18(CAN-H) R3.1 U3.7(CANH)
CAN-L: J1.2 PCB1.7(CAN-L) PCB1.17(CAN-L) U3.6(CANL)
CAN-RX: U2.1(GP0) U3.4(RXD)
CAN-TX: U2.2(GP1) U3.1(TXD)
CUT: C29.2 R72.2 R74.1 U2.6(GP4) U16.12(A)
DCC-1: U4.13(2C3) U5.13(2C3) U6.13(2C3) U7.13(2C3) U16.10(Y)
DCC-2: U4.3(1C3) U5.3(1C3) U6.3(1C3) U7.3(1C3) U16.4(Y)
DCC-SIG-1: PCB1.1(DCC-1) PCB1.11(DCC-1) PCB1.40(DCC-1) R71.1
DCC-SIG-2: PCB1.2(DCC-2) PCB1.12(DCC-2) PCB1.50(DCC-2) R73.1
ENB-0: R27.1 U9.11(4Y)
ENB-1: R16.1 U9.8(3Y)
ENB-2: R17.2 U9.6(2Y)
ENB-3: R28.2 U9.3(1Y)
EXT: PCB1.43(EXT) Q3.3(D) R10.1
NVM-SCL: R1.2 U1.6(SCL) U2.5(GP3)
NVM-SDA: R2.2 U1.5(SDA) U2.4(GP2)
PEXT: Q3.2(S) R7.2 U2.29(GP22)
PFAIL: C33.1 R75.1 R77.2 U2.7(GP5)
PSCL: Q2.2(S) R8.2 U2.22(GP17)
PSDA: Q1.2(S) R9.2 U2.21(GP16)
RST: B1.3 B1.4 PCB1.53(RST) R4.1 U2.30(RUN)
RSV-1: PCB1.4(RSV1) PCB1.14(RSV1)
RSV-2: PCB1.5(RSV2) PCB1.15(RSV2)
RSV-3: PCB1.6(VS) PCB1.16(VS)
S-0: R26.2 R31.2 U12.8(SENSEA)
S-1: R21.2 R23.2 U11.8(SENSEA)
S-2: R18.2 R22.2 U11.13(SENSEB)
S-3: R13.2 R32.2 U12.13(SENSEB)
SCL: PCB1.49(SCL) Q2.3(D) R11.1
SDA: PCB1.59(SDA) Q1.3(D) R12.1
SEL-0-1: U2.9(GP6) U4.14(SEL A) U8.9(3A)
SEL-0-2: U2.10(GP7) U4.2(SEL B) U8.10(3B)
SEL-1-1: U2.11(GP8) U5.14(SEL A) U8.12(4A)
SEL-1-2: U2.12(GP9) U5.2(SEL B) U8.13(4B)
SEL-2-1: U2.27(GP21) U6.14(SEL A) U8.5(2B)
SEL-2-2: U2.26(GP20) U6.2(SEL B) U8.4(2A)
SEL-3-1: U2.25(GP19) U7.14(SEL A) U8.2(1B)
SEL-3-2: U2.24(GP18) U7.2(SEL B) U8.1(1A)
UART-0: R35.2 U2.14(GP10) U14.13(OUT4) U14.14(OUT3)
UART-1: R34.1 U2.15(GP11) U14.1(OUT1) U14.2(OUT2)
UART-2: R33.2 U2.16(GP12) U15.13(OUT4) U15.14(OUT3)
UART-3: R36.1 U2.17(GP13) U15.1(OUT1) U15.2(OUT2)
V-USB: Q4.1(G) U2.40(VBUS)
VBOOT: C15.2 C22.2 D2.1(2) U11.17(VBOOT) U12.17(VBOOT)
VS: C14.2 C16.1 C21.2 C23.1 C26.2 C27.2 D1.2(1) D3.1(A) PCB1.20(VS) PCB1.64(PO-2) PCB1.65(PO-4) PCB1.66(PO-6) PCB1.67(PO-8) R37.2 R39.2 R50.2 R52.2 R54.2 R56.2 R65.2 R67.2 U11.2(VSA) U11.19(VSB) U12.2(VSA) U12.19(VSB) U14.3(VCC) U15.3(VCC)
Net-(C9-1): C9.1 U11.4(VCP)
Net-(C9-2): C9.2 D1.1(2) D2.2(1)
Net-(C10-1): C10.1 R13.1 U10.3(INA+)
Net-(C12-1): C12.1 R18.1 U10.5(INB+)
Net-(C13-2): C13.2 R16.2 U11.5(ENA)
Net-(C17-2): C17.2 R17.1 U11.16(ENB)
Net-(C18-1): C18.1 R23.1 U10.10(INC+)
Net-(C19-1): C19.1 R26.1 U10.12(IND+)
Net-(C20-2): C20.2 R27.2 U12.5(ENA)
Net-(C24-2): C24.2 R28.1 U12.16(ENB)
Net-(C30-2): C30.2 R74.2 U16.13(B)
Net-(C31-1): C31.1 D3.2(K) U18.1(VIN)
Net-(C34-1): C34.1 R76.2
Net-(D4-2): D4.2(K) Q4.3(D) R76.1
Net-(J1-1): J1.1 R3.2
Net-(LED1-1): LED1.1 U2.19(GP14)
Net-(LED1-2): LED1.2 R5.1
Net-(LED2-1): LED2.1 U2.20(GP15)
Net-(LED2-2): LED2.2 R6.1
Net-(R14-2): R14.2 R15.2 U10.2(INA-)
Net-(R19-2): R19.2 R20.2 U10.6(INB-)
Net-(R24-2): R24.2 R25.2 U10.9(INC-)
Net-(R29-2): R29.2 R30.2 U10.13(IND-)
Net-(R37-1): R37.1 R41.2 U14.5(IN2+)
Net-(R38-1): R38.1 R42.2 U14.4(IN2-)
Net-(R39-1): R39.1 R43.2 U15.5(IN2+)
Net-(R40-1): R40.1 R44.2 U15.4(IN2-)
Net-(R45-2): R45.2 R49.1 U14.6(IN1-)
Net-(R46-2): R46.2 R50.1 U14.7(IN1+)
Net-(R47-2): R47.2 R51.1 U15.6(IN1-)
Net-(R48-2): R48.2 R52.1 U15.7(IN1+)
Net-(R53-1): R53.1 R57.2 U14.8(IN3-)
Net-(R54-1): R54.1 R58.2 U14.9(IN3+)
Net-(R55-1): R55.1 R59.2 U15.8(IN3-)
Net-(R56-1): R56.1 R60.2 U15.9(IN3+)
Net-(R61-2): R61.2 R65.1 U14.11(IN4+)
Net-(R62-2): R62.2 R66.1 U14.10(IN4-)
Net-(R63-2): R63.2 R67.1 U15.11(IN4+)
Net-(R64-2): R64.2 R68.1 U15.10(IN4-)
Net-(R69-1): R69.1 U16.1(A) U16.9(B) U17.7(V01)
Net-(R70-1): R70.1 U16.2(B) U16.6(B) U17.6(V02)
Net-(R71-2): R71.2 U17.1(VF1+) U17.3(VF1_)
Net-(R72-1): R72.1 U16.3(Y)
Net-(R73-2): R73.2 U17.2(VF1_) U17.4(VF1+)
Net-(U8.1-11): U8.11(4Y) U9.9(3A)
Net-(U8.2-8): U8.8(3Y) U9.12(4A)
Net-(U8.3-6): U8.6(2Y) U9.4(2A)
Net-(U8.4-3): U8.3(1Y) U9.1(1A)

Not connected (* = marked no-connect by the designer): PCB1 42(ADC-0)* 44(DIO-0)* 45(DIO-2)* 46(DIO-4)* 47(DIO-6)* 54(DIO-1)* 55(DIO-3)* 56(DIO-5)* 57(DIO-7)*; U2 35(VRef)* 37(3V3_En)* 41(SWLCK)* 42(GND)* 43(SWDIO)*; U8 14(VCC); U9 7(GND) 14(VCC); U12 4(VCP)*; U13 1(Y4)* 2(Y6)* 4(Y7)* 5(Y5)* 7(VEE)*; U16 7(GND) 14(VCC-3V3)

## Notes on the sheets
sheet 1
- Block 0
- DCC Signal Detect
  Control Logic
- Cutout
- H-Bridge
- RC
  detector
- Disable
- B-Ctrl-0
- Meas-0
- RC-In-0
- Analog
  OpAmp
- CAN
  Driver
- LCS Bus Connector
- Analog
  Input/Select
- Block 1
- Track Connector
- Select
- H-Bridge
- RC
  detector
- NVM
  Memory
- I2C
- B-Ctrl-1
- Meas-1
- RC-In-1
- Analog
  OpAmp
- Bridge-Control
- Raspberry PI
  PICO
- Block 2
- Serial In
- RC
- B-Ctrl-2
- H-Bridge
- RC
  detector
- Meas-2
- RC-In-2
- Analog
  OpAmp
- Extension Connector
- I2C
  extern
- Block 3
- B-Ctrl-3
- Extension Connector
- Meas-3
- RC
  detector
- RC-In-3
- H-Bridge
- LEDs, Button
- Analog
  OpAmp
- Power Supply
- Power
- Power
sheet 2
- Block 0
- Block 1
- Block 2
- Block 3
- Control Logic Signals:
  Select -> B-x-1 B-x-2  ENB-x  STATE
  00     -> GND   GND    GND        "Z"
  01     -> VCC   GND    PWM/BLK    "FWD"
  10     -> GND   VCC    PWM/BLK    "REV"
  11     -> DCC1  DCC2   DCC/BLK    "DCC"
- ENB == LOW -> Z
sheet 3
- Non-Volatile Memory
- I2C Adr: 1010_000
- CAN Bus Line Driver
- Level shifters
- Ready
- Active
- Reset
sheet 4
- H-Bridges
- Bridge Current Sensing
- LM324
- Block 1
- Block 2
- Block 0
- Block 3
- ADC-Multiplexer
sheet 5
- place near IC
- place near IC
sheet 6
- Power Supply with Powerfail Option
- Block Controller PCB connectors
- *
- * optional, only for PFAIL option
sheet 7
- LCS Bus - DCC Signal Input
- T=R*C
- DCC Signal, Cutout and Block Signal.
- +
- DCC Input:
  00->CUTOUT
  01->DCC+
  10->DCC-
- Cutout Period
- DCC
- -
- CUT
- 0
- BLK
- 0
